# Altium project Video_Processing_Board.PrjPcb (part 2 of 2)

## Sheet Input Transceivers.SchDoc
size A2; SheetNumber: 5; SheetTotal: 8; SPICEModelCacheFVAKUUFU: <root> / <DocumentId>FVAKUUFU</DocumentId> / </root>
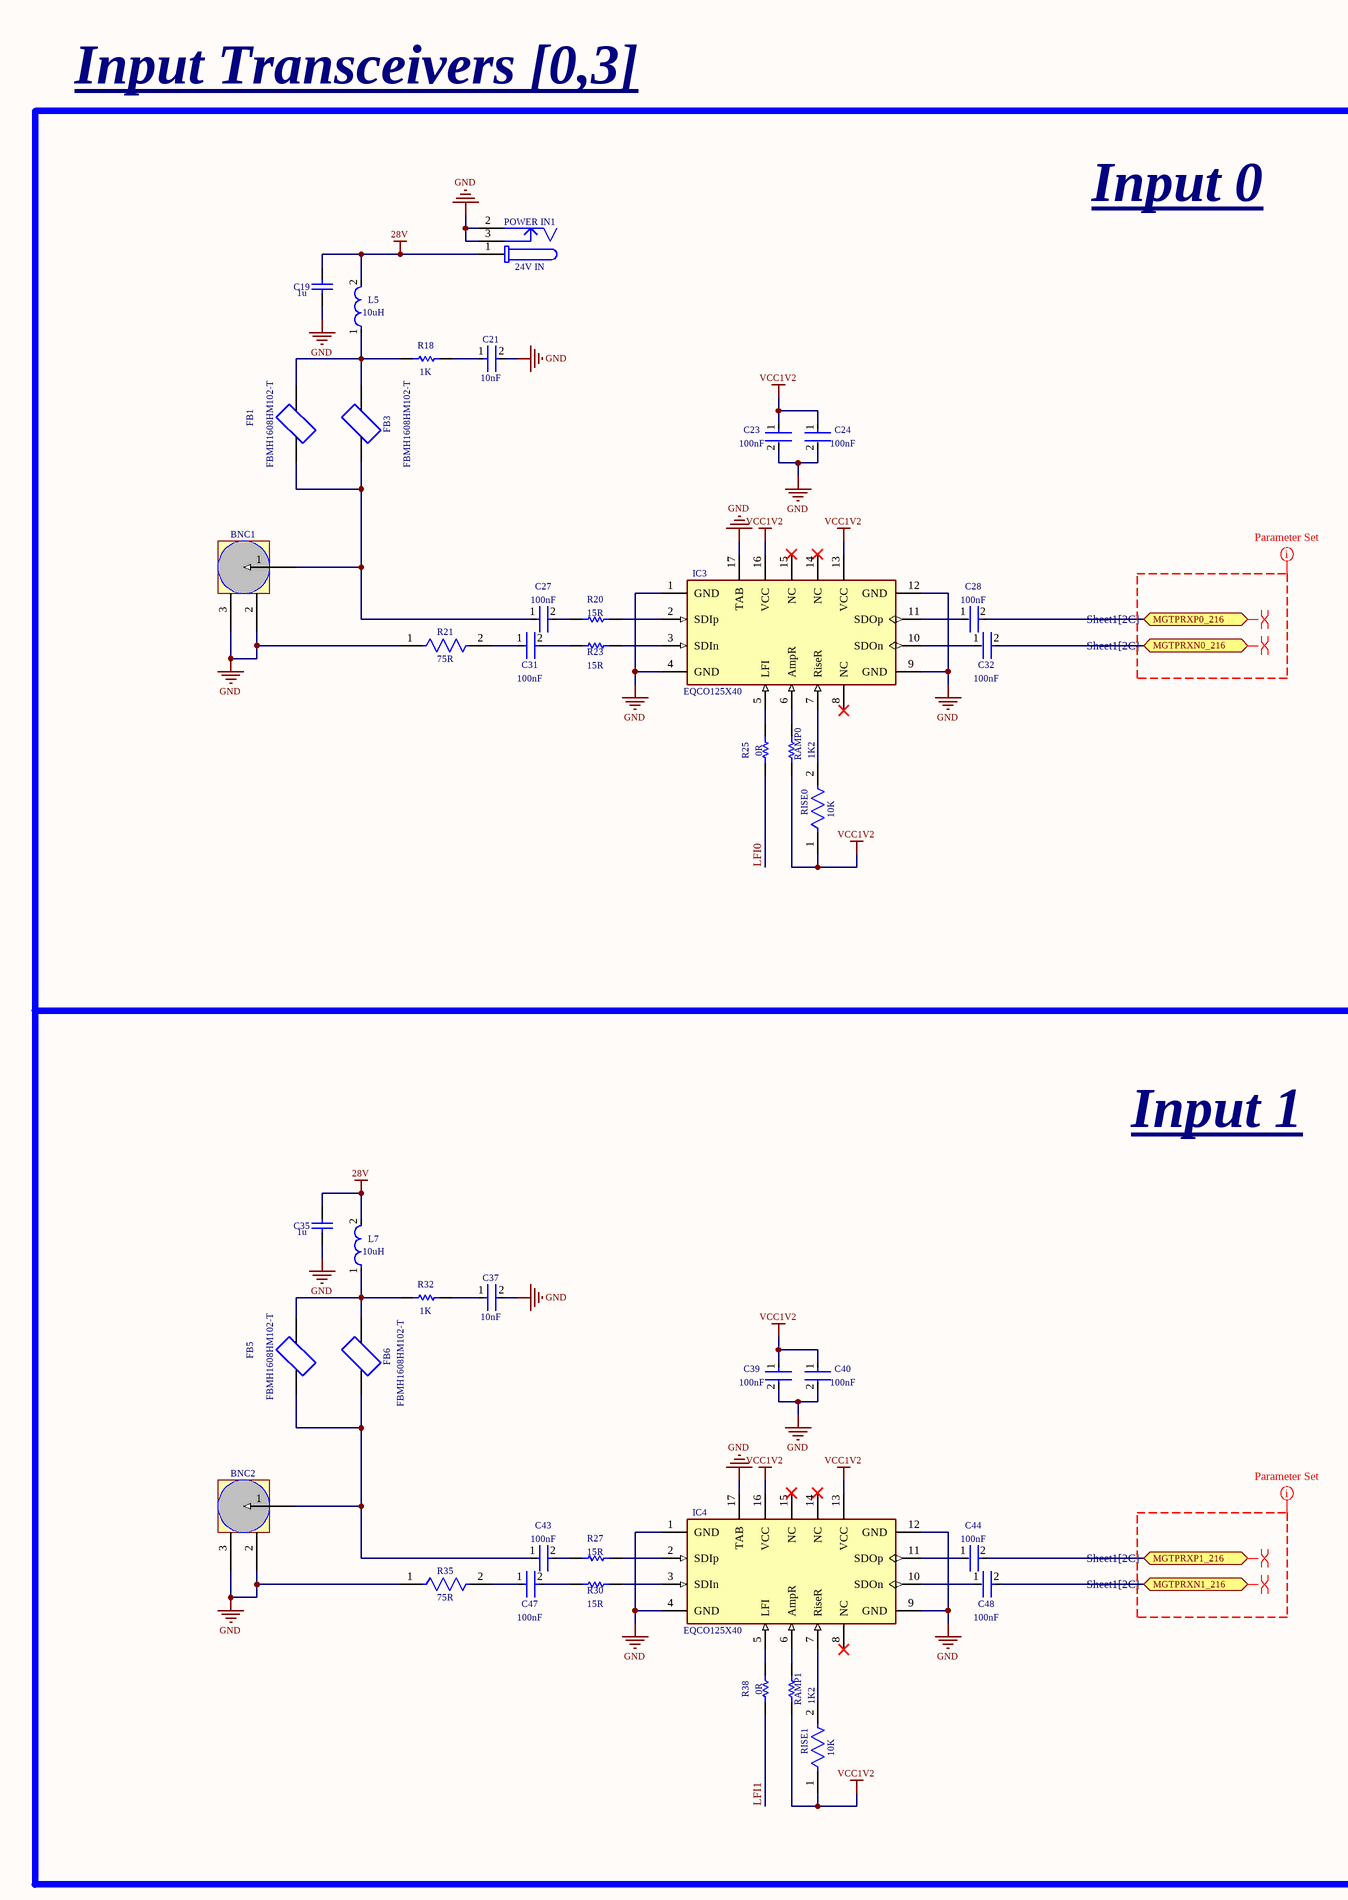
[diagram p4: Input Transceivers.SchDoc, left]
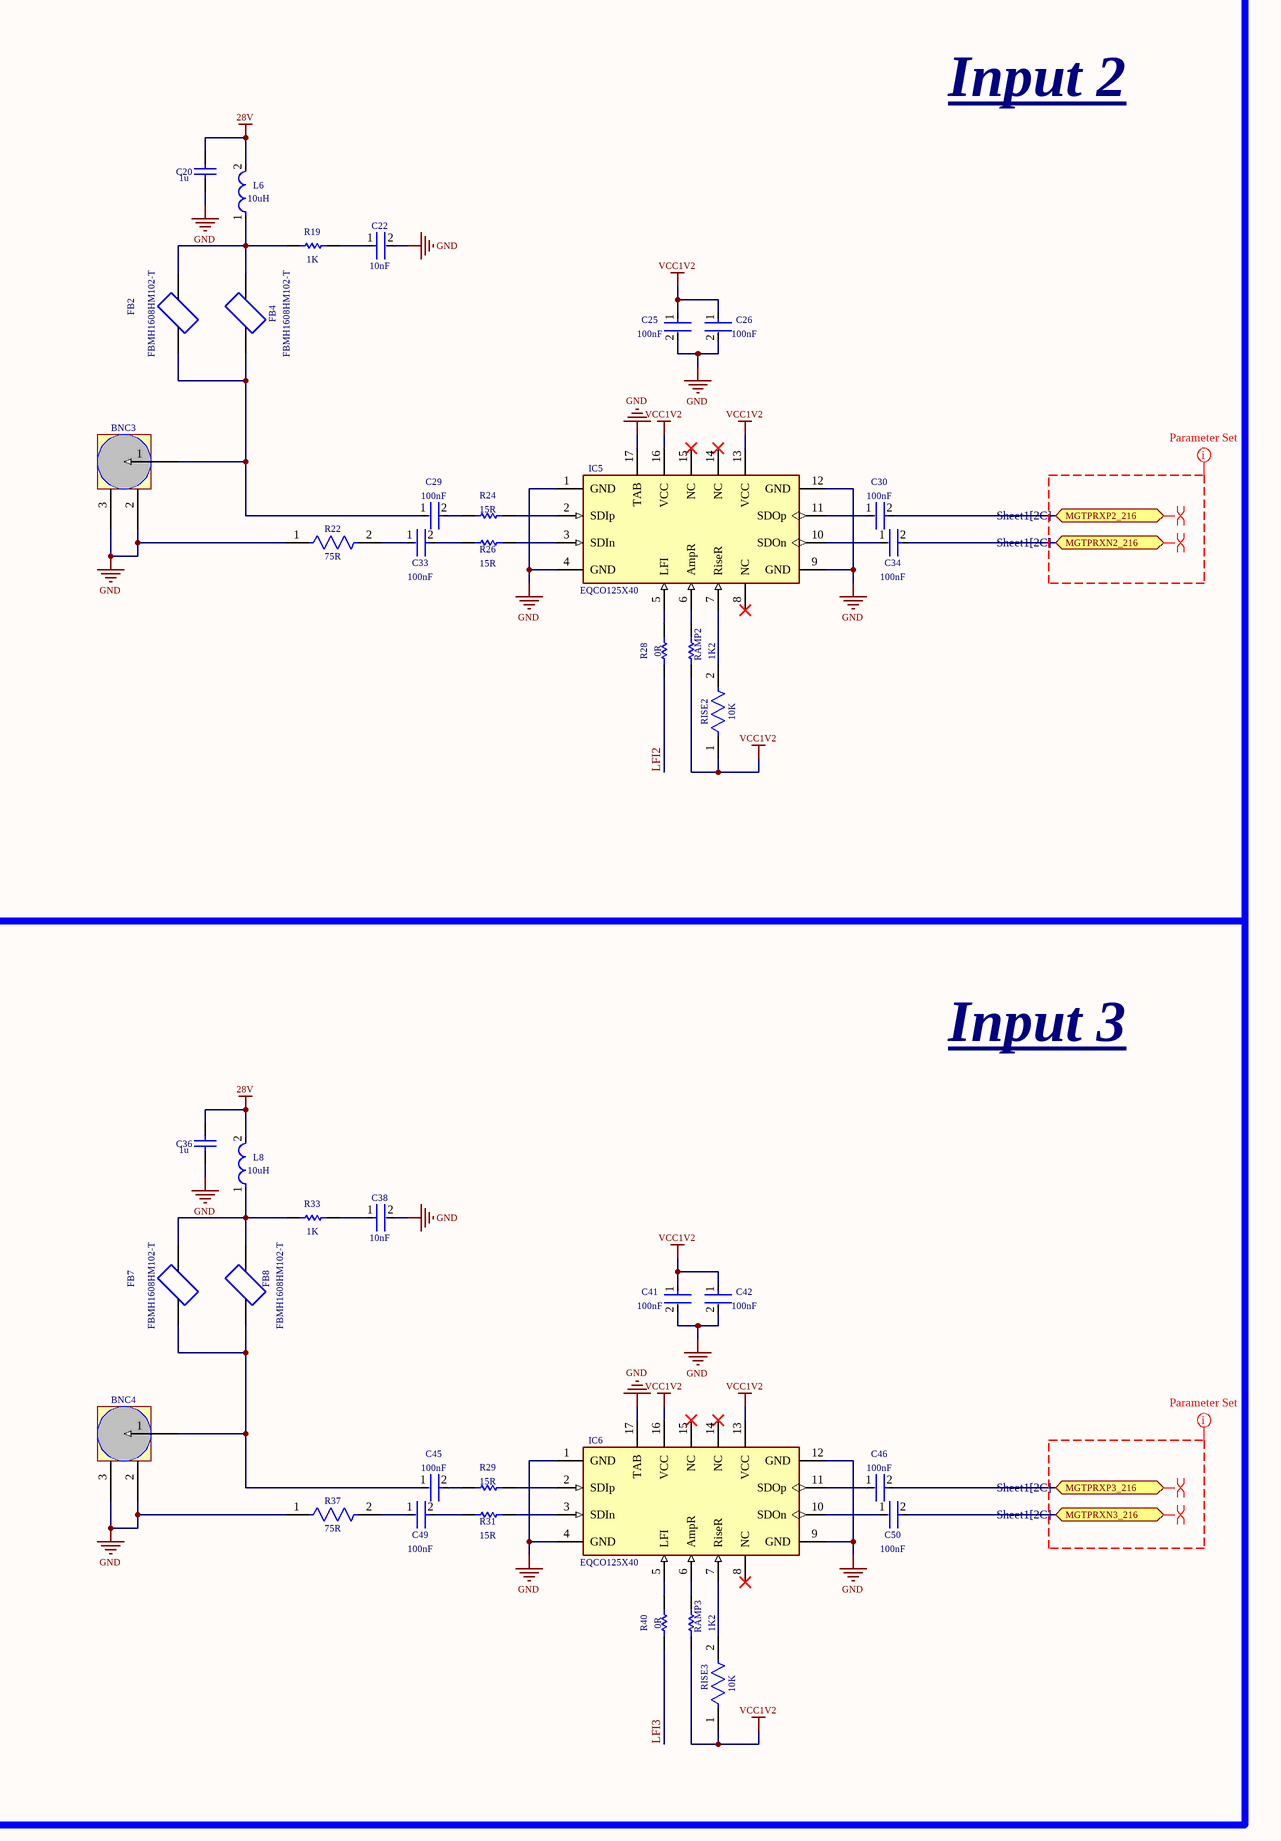
[diagram p5: Input Transceivers.SchDoc, right]

### Parts
BNC1  Amphenol_BNC_HD_034_1018  [PCBComponent_1 - duplicate]  (value not drawn)
BNC2  Amphenol_BNC_HD_034_1018  [PCBComponent_1 - duplicate]  (value not drawn)
BNC3  Amphenol_BNC_HD_034_1018  [PCBComponent_1 - duplicate]  (value not drawn)
BNC4  Amphenol_BNC_HD_034_1018  [PCBComponent_1 - duplicate]  (value not drawn)
C19  1u  [CAPC2013X135X45LL10T25]
C20  1u  [CAPC2013X135X45LL10T25]
C21  10nF  [FP-CL165-IPC_C]
C22  10nF  [FP-CL165-IPC_C]
C23  100nF  [FP-C0402-BB-MFG]
C24  100nF  [FP-C0402-BB-MFG]
C25  100nF  [FP-C0402-BB-MFG]
C26  100nF  [FP-C0402-BB-MFG]
C27  100nF  [FP-GRM15-MFG]
C28  100nF  [FP-GRM15-MFG]
C29  100nF  [FP-GRM15-MFG]
C30  100nF  [FP-GRM15-MFG]
C31  100nF  [FP-GRM15-MFG]
C32  100nF  [FP-GRM15-MFG]
C33  100nF  [FP-GRM15-MFG]
C34  100nF  [FP-GRM15-MFG]
C35  1u  [CAPC2013X135X45LL10T25]
C36  1u  [CAPC2013X135X45LL10T25]
C37  10nF  [FP-CL165-IPC_C]
C38  10nF  [FP-CL165-IPC_C]
C39  100nF  [FP-C0402-BB-MFG]
C40  100nF  [FP-C0402-BB-MFG]
C41  100nF  [FP-C0402-BB-MFG]
C42  100nF  [FP-C0402-BB-MFG]
C43  100nF  [FP-GRM15-MFG]
C44  100nF  [FP-GRM15-MFG]
C45  100nF  [FP-GRM15-MFG]
C46  100nF  [FP-GRM15-MFG]
C47  100nF  [FP-GRM15-MFG]
C48  100nF  [FP-GRM15-MFG]
C49  100nF  [FP-GRM15-MFG]
C50  100nF  [FP-GRM15-MFG]
FB1  FBMH1608HM102-T  [FBMH1608HM102-T]
FB2  FBMH1608HM102-T  [FBMH1608HM102-T]
FB3  FBMH1608HM102-T  [FBMH1608HM102-T]
FB4  FBMH1608HM102-T  [FBMH1608HM102-T]
FB5  FBMH1608HM102-T  [FBMH1608HM102-T]
FB6  FBMH1608HM102-T  [FBMH1608HM102-T]
FB7  FBMH1608HM102-T  [FBMH1608HM102-T]
FB8  FBMH1608HM102-T  [FBMH1608HM102-T]
IC3  EQCO125X40  [EQCO125X40]
IC4  EQCO125X40  [EQCO125X40]
IC5  EQCO125X40  [EQCO125X40]
IC6  EQCO125X40  [EQCO125X40]
L5  10uH  [FP-1812PS-MFG]
L6  10uH  [FP-1812PS-MFG]
L7  10uH  [FP-1812PS-MFG]
L8  10uH  [FP-1812PS-MFG]
POWER_IN1  24V IN  [694102107102]
R18  1K  [RESC1608X55X30LL15T15]
R19  1K  [RESC1608X55X30LL15T15]
R20  15R  [RESC1005X40X25ML10T10]
R21  75R  [FP-ERJ2RK-IPC_B]
R22  75R  [FP-ERJ2RK-IPC_B]
R23  15R  [RESC1005X40X25ML10T10]
R24  15R  [RESC1005X40X25ML10T10]
R25  0R  [RESC1005X40X25NL05T10]
R26  15R  [RESC1005X40X25ML10T10]
R27  15R  [RESC1005X40X25ML10T10]
R28  0R  [RESC1005X40X25NL05T10]
R29  15R  [RESC1005X40X25ML10T10]
R30  15R  [RESC1005X40X25ML10T10]
R31  15R  [RESC1005X40X25ML10T10]
R32  1K  [RESC1608X55X30LL15T15]
R33  1K  [RESC1608X55X30LL15T15]
R35  75R  [FP-ERJ2RK-IPC_B]
R37  75R  [FP-ERJ2RK-IPC_B]
R38  0R  [RESC1005X40X25NL05T10]
R40  0R  [RESC1005X40X25NL05T10]
RAMP0  1K2  [RESC1608X55X25LL10T15]
RAMP1  1K2  [RESC1608X55X25LL10T15]
RAMP2  1K2  [RESC1608X55X25LL10T15]
RAMP3  1K2  [RESC1608X55X25LL10T15]
RISE0  10K  [FP-RC0603-0_55-IPC_C]
RISE1  10K  [FP-RC0603-0_55-IPC_C]
RISE2  10K  [FP-RC0603-0_55-IPC_C]
RISE3  10K  [FP-RC0603-0_55-IPC_C]

### Ports
MGTPRXN0_216 (bidir, see Sheet1[2C]), MGTPRXN1_216 (bidir, see Sheet1[2C]), MGTPRXN2_216 (bidir, see Sheet1[2C]), MGTPRXN3_216 (bidir, see Sheet1[2C]), MGTPRXP0_216 (bidir, see Sheet1[2C]), MGTPRXP1_216 (bidir, see Sheet1[2C]), MGTPRXP2_216 (bidir, see Sheet1[2C]), MGTPRXP3_216 (bidir, see Sheet1[2C])

### Nets
28V: C19.2 C20.2 C35.2 C36.2 L5.2 L6.2 L7.2 L8.2 POWER_IN1.1
GND: BNC1.2 BNC1.3 BNC2.2 BNC2.3 BNC3.2 BNC3.3 BNC4.2 BNC4.3 C19.1 C20.1 C21.2 C22.2 C23.2 C24.2 C25.2 C26.2 C35.1 C36.1 C37.2 C38.2 C39.2 C40.2 C41.2 C42.2 IC3.1(GND) IC3.4(GND) IC3.9(GND) IC3.12(GND) IC3.17(TAB) IC4.1(GND) IC4.4(GND) IC4.9(GND) IC4.12(GND) IC4.17(TAB) IC5.1(GND) IC5.4(GND) IC5.9(GND) IC5.12(GND) IC5.17(TAB) IC6.1(GND) IC6.4(GND) IC6.9(GND) IC6.12(GND) IC6.17(TAB) POWER_IN1.2 POWER_IN1.3 R21.1 R22.1 R35.1 R37.1
VCC1V2: C23.1 C24.1 C25.1 C26.1 C39.1 C40.1 C41.1 C42.1 IC3.13(VCC) IC3.16(VCC) IC4.13(VCC) IC4.16(VCC) IC5.13(VCC) IC5.16(VCC) IC6.13(VCC) IC6.16(VCC) RAMP0.1 RAMP1.1 RAMP2.1 RAMP3.1 RISE0.1 RISE1.1 RISE2.1 RISE3.1
LFI0: R25.1
LFI1: R38.1
LFI2: R28.1
LFI3: R40.1
NetBNC1_1: BNC1.1 C27.1 FB1.1 FB3.1
NetBNC2_1: BNC2.1 C43.1 FB5.1 FB6.1
NetBNC3_1: BNC3.1 C29.1 FB2.1 FB4.1
NetBNC4_1: BNC4.1 C45.1 FB7.1 FB8.1
NetC21_1: C21.1 R18.2
NetC22_1: C22.1 R19.2
NetC27_2: C27.2 R20.1
NetC28_1: C28.1 IC3.11(SDOp)
NetC28_2: C28.2 ; port MGTPRXP0_216
NetC29_2: C29.2 R24.1
NetC30_1: C30.1 IC5.11(SDOp)
NetC30_2: C30.2 ; port MGTPRXP2_216
NetC31_1: C31.1 R21.2
NetC31_2: C31.2 R23.1
NetC32_1: C32.1 IC3.10(SDOn)
NetC32_2: C32.2 ; port MGTPRXN0_216
NetC33_1: C33.1 R22.2
NetC33_2: C33.2 R26.1
NetC34_1: C34.1 IC5.10(SDOn)
NetC34_2: C34.2 ; port MGTPRXN2_216
NetC37_1: C37.1 R32.2
NetC38_1: C38.1 R33.2
NetC43_2: C43.2 R27.1
NetC44_1: C44.1 IC4.11(SDOp)
NetC44_2: C44.2 ; port MGTPRXP1_216
NetC45_2: C45.2 R29.1
NetC46_1: C46.1 IC6.11(SDOp)
NetC46_2: C46.2 ; port MGTPRXP3_216
NetC47_1: C47.1 R35.2
NetC47_2: C47.2 R30.1
NetC48_1: C48.1 IC4.10(SDOn)
NetC48_2: C48.2 ; port MGTPRXN1_216
NetC49_1: C49.1 R37.2
NetC49_2: C49.2 R31.1
NetC50_1: C50.1 IC6.10(SDOn)
NetC50_2: C50.2 ; port MGTPRXN3_216
NetFB1_2: FB1.2 FB3.2 L5.1 R18.1
NetFB2_2: FB2.2 FB4.2 L6.1 R19.1
NetFB5_2: FB5.2 FB6.2 L7.1 R32.1
NetFB7_2: FB7.2 FB8.2 L8.1 R33.1
NetIC3_2: IC3.2(SDIp) R20.2
NetIC3_3: IC3.3(SDIn) R23.2
NetIC3_5: IC3.5(LFI) R25.2
NetIC3_6: IC3.6(AmpR) RAMP0.2
NetIC3_7: IC3.7(RiseR) RISE0.2
NetIC4_2: IC4.2(SDIp) R27.2
NetIC4_3: IC4.3(SDIn) R30.2
NetIC4_5: IC4.5(LFI) R38.2
NetIC4_6: IC4.6(AmpR) RAMP1.2
NetIC4_7: IC4.7(RiseR) RISE1.2
NetIC5_2: IC5.2(SDIp) R24.2
NetIC5_3: IC5.3(SDIn) R26.2
NetIC5_5: IC5.5(LFI) R28.2
NetIC5_6: IC5.6(AmpR) RAMP2.2
NetIC5_7: IC5.7(RiseR) RISE2.2
NetIC6_2: IC6.2(SDIp) R29.2
NetIC6_3: IC6.3(SDIn) R31.2
NetIC6_5: IC6.5(LFI) R40.2
NetIC6_6: IC6.6(AmpR) RAMP3.2
NetIC6_7: IC6.7(RiseR) RISE3.2

Not connected (* = marked no-connect by the designer): IC3 8(NC)* 14(NC)* 15(NC)*; IC4 8(NC)* 14(NC)* 15(NC)*; IC5 8(NC)* 14(NC)* 15(NC)*; IC6 8(NC)* 14(NC)* 15(NC)*

### Layout directives
differential pair: NetC28_2, NetC30_2, NetC32_2, NetC34_2, NetC44_2, NetC46_2, NetC48_2, NetC50_2

### Notes on the sheet
- Input Transceivers [0,3]
- Input 0
- Input 2
- Input 1
- Input 3

### Library data of the parts
BNC1-BNC4 = Component_1_3
C19 C20 C35 C36 = CMP-1036-04761-2: Manufacturer: Murata; Part Number: GRM21BR71H105KA12L
C21 C22 C37 C38 = CMP-13271-000387-1: Cap Ceramic 10nF 50V X7R ±10% SMD 0402 +125°C Paper T/R; Depth: 0.5mm; Length: 1mm; Lead Free: Lead Free; Case Code (Metric): 1005; Width: 0.02inch; Min Operating Temperature: -55°C; Thickness: 0.022inch; Package Quantity: 1; Mount: Surface Mount; Height: 0.5mm; Voltage: 50V; Material: Ceramic; Tolerance: 10%; Case Code (Imperial): 0402; Radiation Hardening: No; Case/Package: 0402; Max Operating Temperature: 125°C; Voltage Rating (DC): 50V; Contact Plating: Tin; Packaging: Tape and Reel; Voltage Rating: 50V; Capacitance: 10nF; Dielectric: X7R
C23-C26 C39-C42 = CMP-2008-02108-2: CAP CER 0.1UF 16V X7R 0402; Manufacturer: Kemet; Manufacturer Part Number: C0402C104K4RACTU; Value: 0.10 μF; Tolerance: 0.1; Material: Ceramic; Temperature Coefficient: 15%; Voltage Rating: 16 V; Package: C0402-BB; Automotive: No; Ipc Land Pattern Name: CAPC10050X50; Device Class L3: Ceramic Capacitors; Capacitance: 0.10 μF; Octopart: https://octopart.com/c0402c104k4ractu-kemet-94158; Temperature Characteristic: X7R; Mouser Description: Cap Ceramic 0.1uF 16V X7R 10% SMD 0402 125?C Paper T/R - Tape and Reel (Alt: C0402C104K4RAC TU); ComponentLink2Description: Datasheet; Temperature Range Low: -55°C; RoHS: TRUE; Device Class L1: Passive Components; Temperature Range High: +125°C; Device Class L2: Capacitors; ComponentLink2URL: https://content.kemet.com/datasheets/KEM_C1002_X7R_SMD.pdf; Category: Cap; Height: 0.55mm; Temperature: -55°C to +125°C; Lead Free: Yes; Digikey Description: CAP CER 0.1UF 16V X7R 0402
C27-C34 C43-C50 = CMP-2100-03641-2: CAP CER 0.1UF 16V X7R 0402; Manufacturer Part Number: GRM155R71C104KA88D; Manufacturer: Murata; Standoff Height: 0mm; Tolerance: 10%; Voltage Rating: 16Vdc; Material: Ceramic; Capacitance: 0.10μF; Value: 0.10μF; RoHS: TRUE; Temperature Characteristic: X7R; Octopart: https://octopart.com/grm155r71c104ka88d-murata-196880; Digikey Description: CAP CER 0.1UF 16V X7R 0402; Device Class L3: Ceramic Capacitors; Height: 0.55mm; ComponentLink2Description: Datasheet; Temperature Range Low: -55°C; Ipc Land Pattern Name: CAPC10050X219; ComponentLink2URL: https://search.murata.co.jp/Ceramy/image/img/A01X/G101/ENG/GRM155R71H471KA01-01A.pdf; Device Class L1: Passive Components; Lead Free: yes; Category: Cap; Package: GRM15; Temperature: -55°C to +125°C; Device Class L2: Capacitors; Temperature Range High: +125°C; Mouser Description: 0402 0.1 uF 16V ±10 % Tolerance X7R SMT Multilayer Ceramic Capacitor
FB1-FB8 = FBMH1608HM102-T: Jumper; Part_Number: J00001; ID: 110; Mounting_Type: SMT; Part_Name: Jumper; ComponentLink1Description: Datasheet
IC3-IC6 = EQCO125X40: 12.5 Gbps Asymmetric Equalizer/Driver/Repeater; Part_Number: J00001; Part_Name: Jumper; ID: 110; Mounting_Type: SMT; ComponentLink1Description: Datasheet
L5-L8 = CMP-11268-000188-1: Fixed Inductors 1812PS Hi SRF Shlded 10uH 5 % 1.7 A; Core Material: Ferrite; Test Frequency: 100kHz; DC Resistance (DCR): 170mR; Self Resonant Frequency: 120MHz; Q Factor: 40; Shielding: Shielded; Tolerance: 5%; Max DC Current: 1.7A; Inductance: 10uH; Height: 3.81mm; Length: 5.87mm; Case/Package: 1812; Series: 1812PS; Packaging: Tape and Reel; Package Quantity: 600; Width: 4.98mm; Max Operating Temperature: 105°C; Termination: SMD/SMT; Lead Free: Contains Lead; Min Operating Temperature: -40°C; RoHS Compliant: Yes
POWER_IN1 = CMP-1502-00174-2: NexarPartId: 52645180; Connector Type: Power; Insulation Resistance: 100MΩ; Gender: Male; Current Rating: 5A; Voltage Rating: 18V; Shielding: Unshielded; Mount: Surface Mount; Packaging: Tape and Reel; Max Operating Temperature: 85°C; Color: Black; Contact Plating: Tin; Min Operating Temperature: -40°C; Housing Material: Polyamide; Termination: SMD/SMT; RoHS: Compliant; Contact Gender: Female; REACH SVHC: Unknown; Voltage Rating (DC): 18V; Operating Supply Voltage: 18V; Flammability Rating: UL94 V-0
R18 R19 R32 R33 = CMP-2000-00180-1: Part Number: ERJ-3EKF1001V; Manufacturer: Panasonic
R20 R23 R24 R26 R27 R29-R31 = CMP-2002-05954-1: Manufacturer: Multicomp; Part Number: MC00625W0402115R
R21 R22 R35 R37 = CMP-2002-01061-2: RES SMD 75 OHM 1% 1/10W 0402; Max Power Dissipation: 100mW; Voltage Rating: 50V; Temperature Coefficient: 100ppm/°C; Radiation Hardening: No; Resistor Type: Thick Film; Contact Plating: Tin; Military Standard: Not; Package Quantity: 1; Packaging: Tape and Reel; Resistance Tolerance: 1%; RoHS Compliant: Yes; Depth: 0.5mm; Construction: Rectangular; Series: ERJ; Resistance: 75R; Lead Free: Lead Free; REACH SVHC: No SVHC; Power Rating: 100mW; Length: 1mm; Termination: SMD/SMT; Case Code (Metric): 1005; Features: Automotive AEC-Q200; Case/Package: 0402; Technology: THICK FILM; Case Code (Imperial): 0402; Tolerance: 1%; Max Operating Temperature: 155°C; Size Code: 0402; Min Operating Temperature: -55°C; Number of Terminations: 2; Voltage Rating (DC): 50V; Height: 0.35mm; Mount: Surface Mount; Width: 0.02inch
R25 R28 R38 R40 = CMP-1011-00001-2: Manufacturer: Yageo / Phycomp; Part Number: RC0402JR-070RL
RAMP0-RAMP3 = CMP-1659-00042-1: Chip Resistor, 1.2 KOhm, +/- 1%, 0.1 W, -55 to 155 degC, 0603 (1608 Metric), RoHS, Tape and Reel; Resistance: 825 kohm; Voltage Rating: 50 V; Power Rating: 100 mW; Case\Package: 0603; DatasheetVersion: Rev. 4, 02/2016; Package Quantity: 5000; Min Operating Temperature: -55 degC; PackageReference: 0603; ComponentLink1Description: Manufacturer URL; Tolerance: 1%; ComponentLink2Description: Datasheet; Packaging: Tape and Reel; PackageDescription: 2-Pin Surface Mount Device, Body 1.6 x 0.8 mm; Width: 0.8 mm; ComponentLink2URL: http://www.yageo.com/documents/recent/PYu-RC_Group_51_RoHS_L_04.pdf; ComponentLink1URL: http://www.yageo.com/; Max Operating Temperature: 155 degC; RoHSCompliant: true; Height: 0.45 mm; Case Code (Imperial): 0603; Case Code (Metric): 1608; Length: 1.6 mm
RISE0-RISE3 = CMP-2100-03664-2: RES 10K OHM 1% 1/10W 0603; Voltage Rating: 75V; Voltage Rating (DC): 50V; Resistance: 10kR; Power Rating: 100mW; Temperature Coefficient: 100ppm/°C; Depth: 0.8mm; Termination: SMD/SMT; Resistor Type: Thick Film; Series: RC; Construction: Rectangular; Features: Moisture Resistant; Packaging: Tape and Reel; Min Operating Temperature: -55°C; Number of Terminations: 2; Lead Pitch: 0.3mm; RoHS Compliant: Yes; Case/Package: 0603; Resistance Tolerance: 1%; Military Standard: Not; Weight: 7.1E-05oz; Number of Pins: 2; Tolerance: 1%; Length: 1.6mm; Case Code (Imperial): 0603; Lead Free: Lead Free; Width: 0.8mm; Max Power Dissipation: 100mW; Height: 0.45mm; Max Operating Temperature: 155°C; Case Code (Metric): 1608; Size Code: 0603

## Sheet Output Transceivers.SchDoc
size A2; SheetNumber: 6; SheetTotal: 8
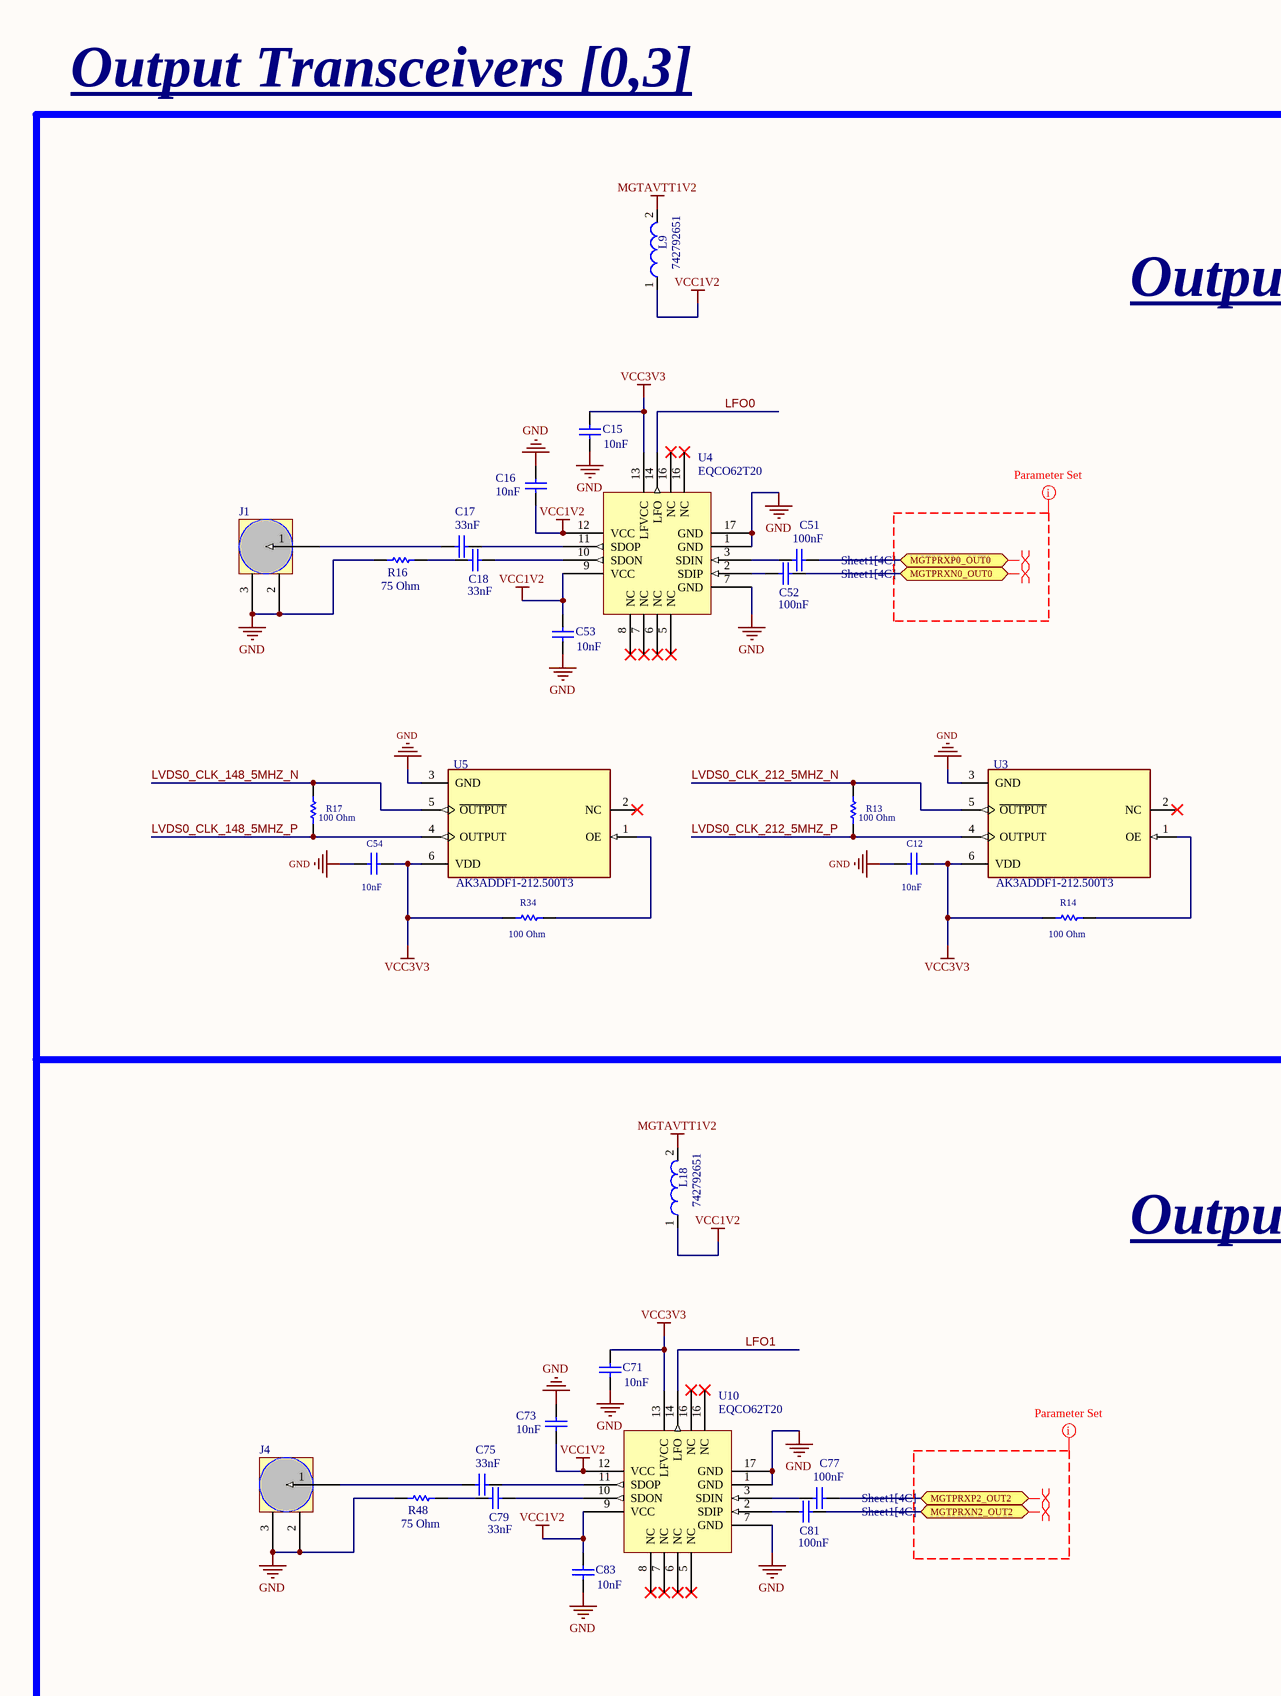
[diagram p6: Output Transceivers.SchDoc, left]
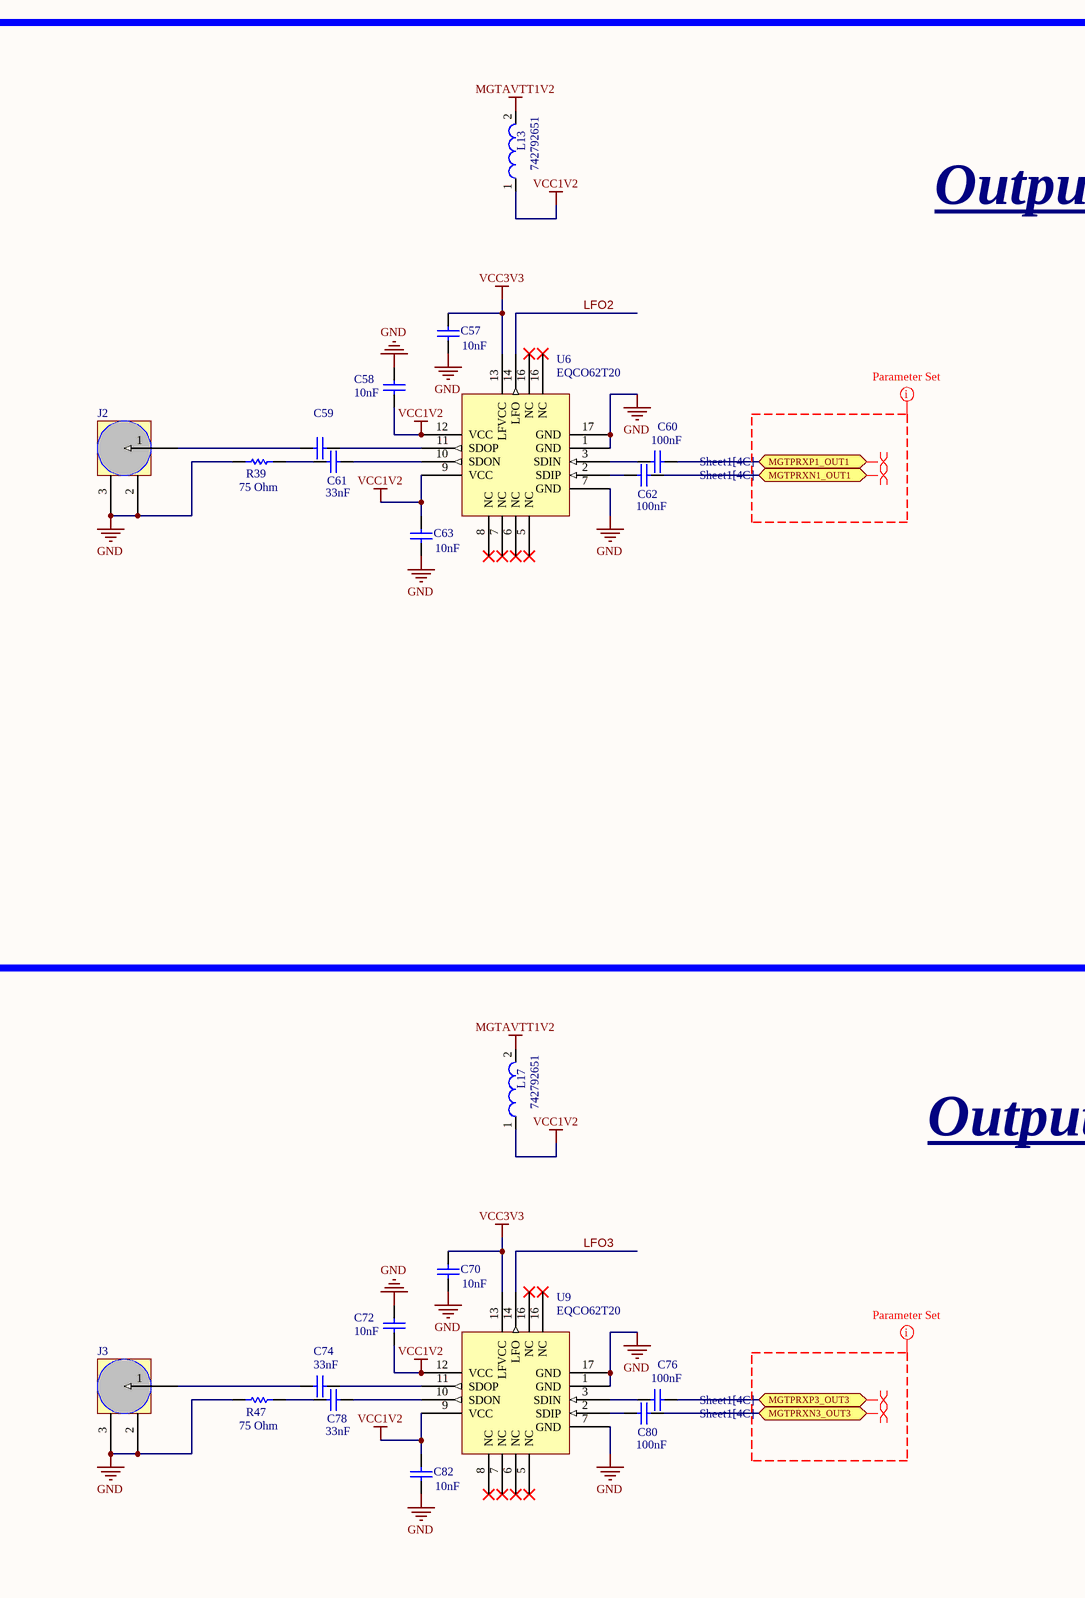
[diagram p7: Output Transceivers.SchDoc, right]

### Parts
C12  10nF  [0402]
C15  10nF  [0402]
C16  10nF  [0402]
C17  33nF  [0603]
C18  33nF  [0603]
C51  100nF  [0402]
C52  100nF  [0402]
C53  10nF  [0402]
C54  10nF  [0402]
C57  10nF  [0402]
C58  10nF  [0402]
C59  33nF  [0603]  (value not drawn)
C60  100nF  [0402]
C61  33nF  [0603]
C62  100nF  [0402]
C63  10nF  [0402]
C70  10nF  [0402]
C71  10nF  [0402]
C72  10nF  [0402]
C73  10nF  [0402]
C74  33nF  [0603]
C75  33nF  [0603]
C76  100nF  [0402]
C77  100nF  [0402]
C78  33nF  [0603]
C79  33nF  [0603]
C80  100nF  [0402]
C81  100nF  [0402]
C82  10nF  [0402]
C83  10nF  [0402]
J1  (no value)  [PCBComponent_1 - duplicate]
J2  (no value)  [PCBComponent_1 - duplicate]
J3  (no value)  [PCBComponent_1 - duplicate]
J4  (no value)  [PCBComponent_1 - duplicate]
L9  742792651  [SMD-0603]
L13  742792651  [SMD-0603]
L17  742792651  [SMD-0603]
L18  742792651  [SMD-0603]
R13  100 Ohm  [3-0603]
R14  100 Ohm  [3-0603]
R16  75 Ohm  [3-0603]
R17  100 Ohm  [3-0603]
R34  100 Ohm  [3-0603]
R39  75 Ohm  [3-0603]
R47  75 Ohm  [3-0603]
R48  75 Ohm  [3-0603]
U3  AK3ADDF1-212.500T3  [AX3DAF1-148.5000T]
U4  EQCO62T20  [PCBComponent_1_2]
U5  AK3ADDF1-212.500T3  [AX3DAF1-148.5000T]
U6  EQCO62T20  [PCBComponent_1_2]
U9  EQCO62T20  [PCBComponent_1_2]
U10  EQCO62T20  [PCBComponent_1_2]

### Ports
MGTPRXN0_OUT0 (bidir, see Sheet1[4C]), MGTPRXN1_OUT1 (bidir, see Sheet1[4C]), MGTPRXN2_OUT2 (bidir, see Sheet1[4C]), MGTPRXN3_OUT3 (bidir, see Sheet1[4C]), MGTPRXP0_OUT0 (bidir, see Sheet1[4C]), MGTPRXP1_OUT1 (bidir, see Sheet1[4C]), MGTPRXP2_OUT2 (bidir, see Sheet1[4C]), MGTPRXP3_OUT3 (bidir, see Sheet1[4C])

### Nets
GND: C12.1 C15.1 C16.2 C53.1 C54.1 C57.1 C58.2 C63.1 C70.1 C71.1 C72.2 C73.2 C82.1 C83.1 J1.2 J1.3 J2.2 J2.3 J3.2 J3.3 J4.2 J4.3 R16.1 R39.1 R47.1 R48.1 U3.3(GND) U4.1(GND) U4.7(GND) U4.17(GND) U5.3(GND) U6.1(GND) U6.7(GND) U6.17(GND) U9.1(GND) U9.7(GND) U9.17(GND) U10.1(GND) U10.7(GND) U10.17(GND)
MGTAVTT1V2: L9.2 L13.2 L17.2 L18.2
VCC1V2: C16.1 C53.2 C58.1 C63.2 C72.1 C73.1 C82.2 C83.2 L9.1 L13.1 L17.1 L18.1 U4.9(VCC) U4.12(VCC) U6.9(VCC) U6.12(VCC) U9.9(VCC) U9.12(VCC) U10.9(VCC) U10.12(VCC)
VCC3V3: C12.2 C15.2 C54.2 C57.2 C70.2 C71.2 R14.1 R34.1 U3.6(VDD) U4.13(LFVCC) U5.6(VDD) U6.13(LFVCC) U9.13(LFVCC) U10.13(LFVCC)
LFO0: U4.14(LFO)
LFO1: U10.14(LFO)
LFO2: U6.14(LFO)
LFO3: U9.14(LFO)
LVDS0_CLK_148_5MHZ_N: R17.2 U5.5(~{OUTPUT})
LVDS0_CLK_148_5MHZ_P: R17.1 U5.4(OUTPUT)
LVDS0_CLK_212_5MHZ_N: R13.2 U3.5(~{OUTPUT})
LVDS0_CLK_212_5MHZ_P: R13.1 U3.4(OUTPUT)
NetC17_1: C17.1 J1.1
NetC17_2: C17.2 U4.11(SDOP)
NetC18_1: C18.1 R16.2
NetC18_2: C18.2 U4.10(SDON)
NetC51_1: C51.1 U4.3(SDIN)
NetC51_2: C51.2 ; port MGTPRXP0_OUT0
NetC52_1: C52.1 U4.2(SDIP)
NetC52_2: C52.2 ; port MGTPRXN0_OUT0
NetC59_1: C59.1 J2.1
NetC59_2: C59.2 U6.11(SDOP)
NetC60_1: C60.1 U6.3(SDIN)
NetC60_2: C60.2 ; port MGTPRXP1_OUT1
NetC61_1: C61.1 R39.2
NetC61_2: C61.2 U6.10(SDON)
NetC62_1: C62.1 U6.2(SDIP)
NetC62_2: C62.2 ; port MGTPRXN1_OUT1
NetC74_1: C74.1 J3.1
NetC74_2: C74.2 U9.11(SDOP)
NetC75_1: C75.1 J4.1
NetC75_2: C75.2 U10.11(SDOP)
NetC76_1: C76.1 U9.3(SDIN)
NetC76_2: C76.2 ; port MGTPRXP3_OUT3
NetC77_1: C77.1 U10.3(SDIN)
NetC77_2: C77.2 ; port MGTPRXP2_OUT2
NetC78_1: C78.1 R47.2
NetC78_2: C78.2 U9.10(SDON)
NetC79_1: C79.1 R48.2
NetC79_2: C79.2 U10.10(SDON)
NetC80_1: C80.1 U9.2(SDIP)
NetC80_2: C80.2 ; port MGTPRXN3_OUT3
NetC81_1: C81.1 U10.2(SDIP)
NetC81_2: C81.2 ; port MGTPRXN2_OUT2
NetR14_2: R14.2 U3.1(OE)
NetR34_2: R34.2 U5.1(OE)

Not connected (* = marked no-connect by the designer): U3 2(NC)*; U4 5(NC)* 6(NC)* 8(NC)* 16(NC)*; U5 2(NC)*; U6 5(NC)* 6(NC)* 8(NC)* 16(NC)*; U9 5(NC)* 6(NC)* 8(NC)* 16(NC)*; U10 5(NC)* 6(NC)* 8(NC)* 16(NC)*

### Layout directives
differential pair: NetC51_2, NetC52_2, NetC60_2, NetC62_2, NetC76_2, NetC77_2, NetC80_2, NetC81_2

### Notes on the sheet
- Output Transceivers [0,3]
- Output 0
- Output 2
- Output 1
- Output 3

### Library data of the parts
C12 C15 C16 C53 C54 C57 C58 C63 C70-C73 C82 C83 = C0402: C0402C103K9RACTU 10nF 6.3V; Note: Footprint corresponds to dimensions for bulk cassette packaging. This case size has tightened tolerances.; Published: 17-Jul-2002; LatestRevisionDate: 19-Mar-2004; LatestRevisionNote: Silkscreen size reduced.; DatasheetDocument: Mar-2001; PackageDocument: Mar-2001; PackageReference: 0402; Publisher: Altium Limited; Code_JEITA: 0402; Code_IPC: 1005 [0402]; ComponentLink1Description: Manufacturer Link; ComponentLink1URL: http://www.kemet.com/; ComponentLink2Description: Datasheet; ComponentLink2URL: http://www.kemet.com/kemet/web/homepage/kechome.nsf/vapubfilesname/F3102TA.pdf/$file/F3102TA.pdf
C17 C18 C59 C61 C74 C75 C78 C79 = C0603: C0603C333K5RACTU 33nF 50V; Note: Footprint corresponds to dimensions for bulk cassette packaging. This case size has tightened tolerances.; Published: 17-Jul-2002; LatestRevisionDate: 19-Mar-2004; LatestRevisionNote: Silkscreen size reduced.; DatasheetDocument: Mar-2001; PackageDocument: Mar-2001; PackageReference: 0603; Publisher: Altium Limited; Code_JEITA: 0603; Code_IPC: 1608 [0603]; ComponentLink1Description: Manufacturer Link; ComponentLink1URL: http://www.kemet.com/; ComponentLink2Description: Datasheet; ComponentLink2URL: http://www.kemet.com/kemet/web/homepage/kechome.nsf/vapubfilesname/F3102TA.pdf/$file/F3102TA.pdf
  C17 C18 C61 C74 C75 C78 C79: Value: 33nF
C51 C52 C60 C62 C76 C77 C80 C81 = C0402: C0402C104K8RACTU 100nF 10V; Note: Footprint corresponds to dimensions for bulk cassette packaging. This case size has tightened tolerances.; Published: 17-Jul-2002; LatestRevisionDate: 19-Mar-2004; LatestRevisionNote: Silkscreen size reduced.; DatasheetDocument: Mar-2001; PackageDocument: Mar-2001; PackageReference: 0402; Publisher: Altium Limited; Code_JEITA: 0402; Code_IPC: 1005 [0402]; ComponentLink1Description: Manufacturer Link; ComponentLink1URL: http://www.kemet.com/; ComponentLink2Description: Datasheet; ComponentLink2URL: http://www.kemet.com/kemet/web/homepage/kechome.nsf/vapubfilesname/F3102TA.pdf/$file/F3102TA.pdf; Value: 100nF
J1-J4 = Component_1: Amphenol_BNC_HD_034_1018
L9 L13 L17 L18 = 742792651: SMD EMI Suppression Ferrite Bead WE-CBF, Z = 600 Ohm; Impedance: 600 Ohm; DatasheetVersion: Dec-2005; PackageVersion: 2009; PackageReference: SMD-0603; PackageDescription: Chip Inductor, 2-Leads, Body 1.6 x 0.8 mm; ComponentLink1Description: Manufacturer URL; ComponentLink1URL: http://www.we-online.com; ComponentLink2Description: Datasheet; ComponentLink2URL: http://www.we-online.de/katalog/media/pdf/742792651.pdf
R13 R14 R16 R17 R34 R39 R47 R48 = ERJ3EK: Precision Thick Film Chip Resistor, 10 Ohm to 1M Ohm Range, 1% and 0.5% Tolerance, 0603 Size, 0.063 W; Published: 17-Dec-2003; LatestRevisionDate: 19-Mar-2004; LatestRevisionNote: Silkscreen size reduced.; PackageDocument: Mar-2003; PackageReference: 3-0603; Publisher: Altium Limited; Code_IPC: 1608 [0603]; ComponentLink1Description: Manufacturer Link; ComponentLink1URL: http://www.panasonic.com/industrial/components/resistive_products.htm; ComponentLink2Description: Datasheet; ComponentLink2URL: http://www.panasonic.com/industrial/components/pdf/AOA0000CE2.pdf
U3 U5 = AX3DAF1-148.5000T: 148.5 MHz XO (Standard) LVDS Oscillator 3.3V Enable/Disable 6-SMD, No Lead; Part_Number: J00001; Part_Name: AX3DAF1-148.5000T3; ID: 110; Mounting_Type: SMT; ComponentLink1Description: Datasheet
U4 U6 U9 U10 = Component_1

## Sheet JTAG & Reset Connection.SchDoc
size A2; SheetNumber: 7; SheetTotal: 8
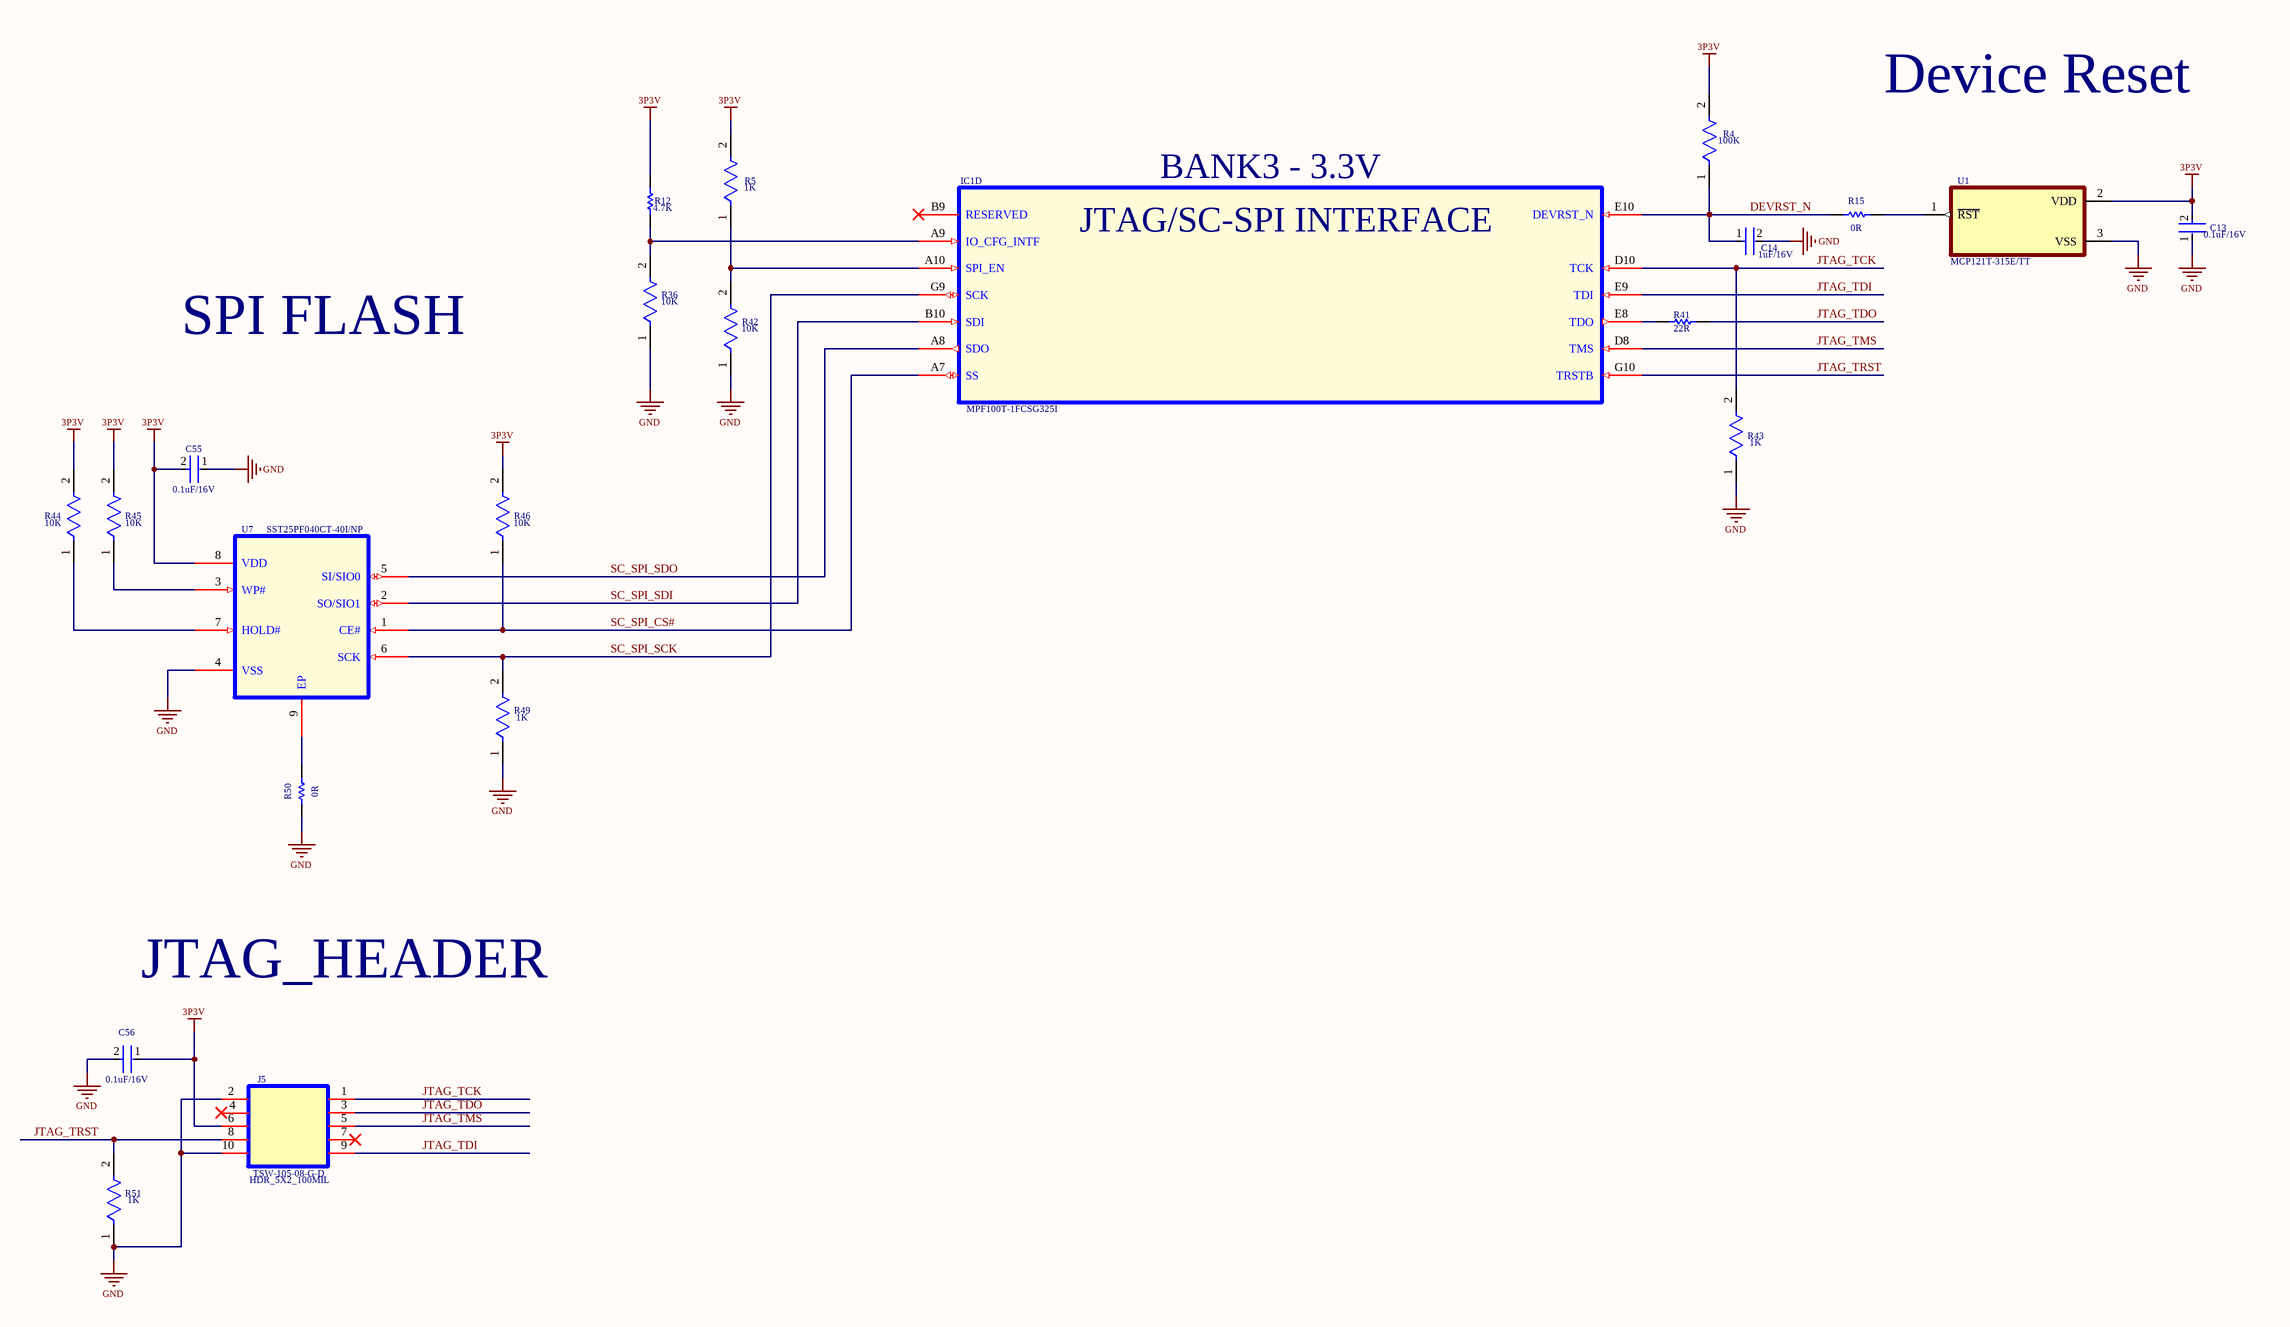
[diagram p8: JTAG & Reset Connection.SchDoc]

### Parts
C13  0.1uF/16V  [FP-GRM15-MFG]
C14  1uF/16V  [FP-0402-L_1_0_0_05-W_0_5-IPC_A]
C55  0.1uF/16V  [FP-GRM15-MFG]
C56  0.1uF/16V  [FP-GRM15-MFG]
IC1  MPF100T-1FCSG325I  [MPF100T-1FCSG325I]  (part D of 9)
J5  TSW-105-08-G-D  Parameter 1: HDR_5X2_100MIL  [TSW-105-08-G-D]
R4  100K  [FP-RC0603-0_55-MFG]
R5  1K  [FP-RC0603-0_55-IPC_C]
R12  4.7K  [RESC1608X55X25LL10T15]
R15  0R  [RESC1005X40X25NL05T10]
R36  10K  [FP-RC0603-0_55-IPC_C]
R41  22R  [RESC1005X40X25LL05T10]
R42  10K  [FP-RC0603-0_55-IPC_C]
R43  1K  [FP-RC0603-0_55-IPC_C]
R44  10K  [FP-RC0603-0_55-IPC_C]
R45  10K  [FP-RC0603-0_55-IPC_C]
R46  10K  [FP-RC0603-0_55-IPC_C]
R49  1K  [FP-RC0603-0_55-IPC_C]
R50  0R  [RESC1005X40X25NL05T10]
R51  1K  [FP-RC0603-0_55-IPC_C]
U1  MCP121T-315E/TT  [MCP121T-315E/TT]
U7  SST25PF040CT-40I/NP  [SST25PF040CT-40I/NP]

### Nets
3P3V: C13.2 C55.2 C56.1 J5.6 R4.2 R5.2 R12.2 R44.2 R45.2 R46.2 U1.2(VDD) U7.8(VDD)
GND: C13.1 C14.2 C55.1 C56.2 J5.2 J5.10 R36.1 R42.1 R43.1 R49.1 R50.1 R51.1 U1.3(VSS) U7.4(VSS)
DEVRST_N: C14.1 IC1.E10(DEVRST_N) R4.1 R15.1
JTAG_TCK: IC1.D10(TCK) J5.1 R43.2
JTAG_TDI: IC1.E9(TDI) J5.9
JTAG_TDO: J5.3 R41.1
JTAG_TMS: IC1.D8(TMS) J5.5
JTAG_TRST: IC1.G10(TRSTB) J5.8 R51.2
SC_SPI_CS#: IC1.A7(SS) R46.1 U7.1(CE#)
SC_SPI_SCK: IC1.G9(SCK) R49.2 U7.6(SCK)
SC_SPI_SDI: IC1.B10(SDI) U7.2(SO/SIO1)
SC_SPI_SDO: IC1.A8(SDO) U7.5(SI/SIO0)
NetIC1_A9: IC1.A9(IO_CFG_INTF) R12.1 R36.2
NetIC1_A10: IC1.A10(SPI_EN) R5.1 R42.2
NetIC1_E8: IC1.E8(TDO) R41.2
NetR15_2: R15.2 U1.1(~{RST})
NetR44_1: R44.1 U7.7(HOLD#)
NetR45_1: R45.1 U7.3(WP#)
NetR50_2: R50.2 U7.9(EP)

Not connected (* = marked no-connect by the designer): IC1 B9(RESERVED)*; J5 4(03) 7(08)*

### Notes on the sheet
- Device Reset
- SPI FLASH
- JTAG_HEADER
- (in symbol MPF100T-1FCSG325I, part D) BANK3 - 3.3V; JTAG/SC-SPI INTERFACE

### Library data of the parts
C13 C55 C56 = CMP-2100-03641-2: as C27 on sheet Input Transceivers; RoHS: TRUE; Temperature Characteristic: X7R; Octopart: https://octopart.com/grm155r71c104ka88d-murata-196880; Digikey Description: CAP CER 0.1UF 16V X7R 0402; Device Class L3: Ceramic Capacitors; Height: 0.55mm; ComponentLink2Description: Datasheet; Temperature Range Low: -55°C; Ipc Land Pattern Name: CAPC10050X219; ComponentLink2URL: https://search.murata.co.jp/Ceramy/image/img/A01X/G101/ENG/GRM155R71H471KA01-01A.pdf; Device Class L1: Passive Components; Lead Free: yes; Category: Cap; Package: GRM15; Temperature: -55°C to +125°C; Device Class L2: Capacitors; Temperature Range High: +125°C; Mouser Description: 0402 0.1 uF 16V ±10 % Tolerance X7R SMT Multilayer Ceramic Capacitor
C14 = CMP-14477-000104-2: None; Tolerance: 10%; Voltage Rating: 16V; Dielectric: X5R; Capacitance: 1uF; Packaging: Tape and Reel; Depth: 0.5mm; Mount: Surface Mount; Thickness: 0.022inch; Package Quantity: 1; Min Operating Temperature: -55°C; Series: M; Voltage Rating (DC): 16V; Termination: SMD/SMT; Case/Package: 0402; Number of Pins: 2; Case Code (Imperial): 0402; Length: 1mm; Halogen Free: Halogen Free; Case Code (Metric): 1005; Width: 0.02inch; RoHS Compliant: Yes; Radiation Hardening: No; Max Operating Temperature: 85°C; Height: 0.5mm; Construction: Flat
IC1 = MPF100T-1FCSG325I: as IC1 on sheet Connector; ComponentLink1Description: Datasheet
J5 = TSW-105-08-G-D: Jumper; Part_Number: J00001; ID: 110; Mounting_Type: SMT; Part_Name: Jumper; ComponentLink1Description: Datasheet
R4 = CMP-2100-03662-2: RES SMD 100K OHM 1% 1/10W 0603; Voltage Rating (DC): 50V; Resistance: 100kR; Max Power Dissipation: 100mW; Temperature Coefficient: 100ppm/°C; Working Voltage: 75V; Length: 1.6mm; Lead Free: Lead Free; Number of Terminations: 2; Packaging: Tape and Reel; Voltage Rating: 50V; Termination: SMD/SMT; Width: 0.8mm; Resistor Type: Thick Film; Resistance Tolerance: 1%; Features: Moisture Resistant; Height: 0.45mm; Construction: Rectangular; Case/Package: 0603; Military Standard: Not; Case Code (Imperial): 0603; Series: RC; Technology: THICK FILM; Depth: 0.8mm; RoHS Compliant: Yes; REACH SVHC: No SVHC; Min Operating Temperature: -55°C; Case Code (Metric): 1608; Max Operating Temperature: 155°C; Power Rating: 100mW; Number of Pins: 2; Tolerance: 1%
R5 R43 R49 R51 = CMP-1659-00009-5: RES 1K OHM 1% 1/10W 0603; Resistance: 1kR; Voltage Rating: 50V; Power Rating: 100mW; Temperature Coefficient: 100ppm/°C; Military Standard: Not; REACH SVHC: No SVHC; Size Code: 0603; Features: Moisture Resistant; Number of Terminations: 2; Technology: THICK FILM; Series: RC; Case Code (Metric): 1608; Resistance Tolerance: 1%; Resistor Type: Thick Film; Termination: SMD/SMT; Contact Plating: Tin; Radiation Hardening: No; Min Operating Temperature: -55°C; Max Operating Temperature: 155°C; Packaging: Tape and Reel; Max Power Dissipation: 100mW; RoHS Compliant: Yes; Height: 0.45mm; Lead Free: Lead Free; Case/Package: 0603; Length: 1.6mm; Tolerance: 1%; Case Code (Imperial): 0603; Construction: Rectangular; Depth: 0.8mm
R12 = CMP-2000-06942-1: Chip Resistor, 4.7 KOhm, +/- 1%, 0.1 W, -55 to 155 degC, 0603 (1608 Metric), RoHS, Tape and Reel; Manufacturer: Yageo; Power Rating: 100mW; Temperature Coefficient: 100PPM/C; Resistance: 4.7kOhms; Voltage Rating: 50V; Package Reference: 0603; Series: RC; Datasheet Version: Rev. 7, 05/2017; Packaging: Reel; Termination Style: SMD/SMT; Datasheet URL: http://www.yageo.com/documents/recent/PYu-RC_Group_51_RoHS_L_7.pdf; Manufacturer URL: http://www.yageo.com/; Package Description: 2-Pin Surface Mount Device, Body 1.6 x 0.8 mm; Case Code - mm: 1608; Case Code - in: 0603; Mounting Technology: SurfaceMount; Operating Temperature Range: -55Cto+155C; Tolerance: 1%; Product: ThickFilmResistorsGeneralPurpose
R15 R50 = CMP-1011-00001-2: as R25 on sheet Input Transceivers
R36 R42 R44-R46 = CMP-2100-03664-2: as RISE0 on sheet Input Transceivers; Depth: 0.8mm; Termination: SMD/SMT; Resistor Type: Thick Film; Series: RC; Construction: Rectangular; Features: Moisture Resistant; Packaging: Tape and Reel; Min Operating Temperature: -55°C; Number of Terminations: 2; Lead Pitch: 0.3mm; RoHS Compliant: Yes; Case/Package: 0603; Resistance Tolerance: 1%; Military Standard: Not; Weight: 7.1E-05oz; Number of Pins: 2; Tolerance: 1%; Length: 1.6mm; Case Code (Imperial): 0603; Lead Free: Lead Free; Width: 0.8mm; Max Power Dissipation: 100mW; Height: 0.45mm; Max Operating Temperature: 155°C; Case Code (Metric): 1608; Size Code: 0603
R41 = CMP-2002-07520-1: Manufacturer: Yageo / Phycomp; Part Number: RC0402FR-0722RL
U1 = MCP121T-315E/TT: Jumper; Part_Number: J00001; ID: 110; Mounting_Type: SMT; Part_Name: Jumper; ComponentLink1Description: Datasheet
U7 = SST25PF040CT-40I/NP: Jumper; Part_Number: J00001; ID: 110; Mounting_Type: SMT; Part_Name: Jumper; ComponentLink1Description: Datasheet

## Sheet USBModule.SchDoc
size A; SheetNumber: 8; SheetTotal: 9; SPICEModelCacheSHGCPFIO: <root> / <DocumentId>SHGCPFIO</DocumentId> / <CacheFrame Number="0"> / <Model Name="emk105bj105_v-f" Kind="CKT"> / <Text>* EMK105BJ105_V-F     SPICE MODEL  ( General Type ) / *-------------------------------------------------------------------------------------------------------- / * Model Generated by TAIYO YUDEN Corporation (http://www.ty-top.com) / * Version 1.0 / * TAIYO YUDEN Control No. 170508_130520 / * Copyright(c) 2012 TAIYO YUDEN CO.,LTD. All Rights Reserved. / *-------------------------------------------------------------------------------------------------------- / * / * Products Name : Multilayer Ceramic Capacitors / * / * Characteristics : / *     Capacitance : 1 uF , Rated Voltage : 16V , TCC : X5R / *     Case Size : 1.0 x 0.5 / 0.039 x 0.02 [mm/inch] , Thickness : 0.5 / 0.02 [mm/inch] / *     (Conditions: Temperature = 25 degC , DC Bias Current/Voltage = 0A / 0V) / * / * Frequency Range : 40Hz - 3GHz / * / * External Node Assignments : / * / *  1  o---| |---o  2 / * / *-------------------------------------------------------------------------------------------------------- / .SubCkt EMK105BJ105_V-F 1 2 / **************************** / C0 1 110 0.68309u / Cm 1 101 0.26053u / C1 101 102 0.94076u / Rc1 101 102 1.9029k / C2 102 103 0.66707u / Rc2 102 103 120.36 / C3 103 110 0.57203u / Rc3 103 110 2.1097 / C2m 1 301 0.1871u / C21 301 302 3.2494u / Rc21 301 302 1.1117k / C22 302 303 2.1014u / Rc22 302 303 1.484k / C23 303 304 2.1172u / Rc23 303 304 1.3876k / C24 304 305 0.75729u / Rc24 304 305 332.59 / C25 305 306 0.94401u / Rc25 305 306 249.09 / C26 306 307 0.34674u / Rc26 306 307 28.352 / C27 307 308 0.37158u / Rc27 307 308 19.989 / C28 308 309 0.17933u / Rc28 308 309 31.748 / C29 309 110 0.016445u / Rc29 309 110 1.0592 / Rp0 1 110 100Meg / L0 110 120 0.2216n / Lm 120 130 0.1509n / L1 120 121 0.12659n / RL1 121 130 0.85161 / L2 120 122 0.15996n / RL2 122 130 0.42469 / L3 120 123 7.9543n / RL3 123 130 0.54643m / CR 120 124 0.24334u / LR 124 125 0.090738n / RR 125 130 68.076m / CL 130 140 2.7354p / LL 130 140 0.10762n / RL 130 140 50.614 / Rs 140 2 7.5416m / **************************** / .ends EMK105BJ105_V-F</Text> / </Model> / </CacheFrame> / </root>
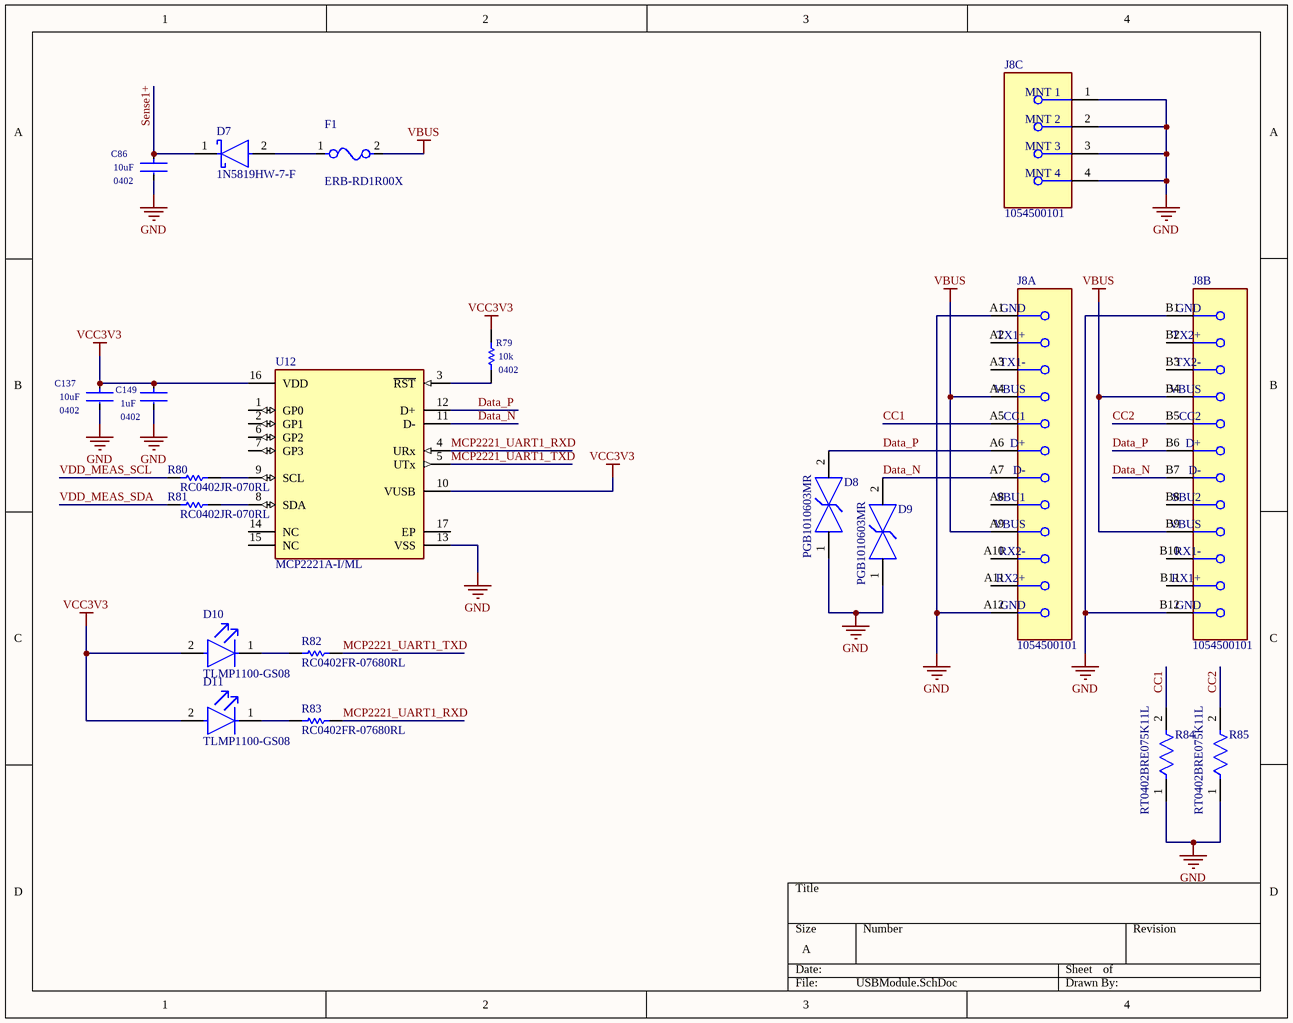
[diagram p9: USBModule.SchDoc]

### Parts
C86  Case/Package: 0402  Capacitance: 10uF  [FP-GRM155-0_2-IPC_B]  (hidden comment: GRM155R60J106ME44D)
C137  Case/Package: 0402  Capacitance: 10uF  [FP-GRM155-0_2-IPC_B]  (hidden comment: GRM155R60J106ME44D)
C149  Case/Package: 0402  Capacitance: 1uF  [FP-0402-L_1_0_0_05-W_0_5-IPC_A]  (hidden comment: EMK105BJ105KV-F)
D7  1N5819HW-7-F  [FP-SOD123-IPC_A]
D8  PGB1010603MR  [FP-PGB1-0603-CA-MFG]
D9  PGB1010603MR  [FP-PGB1-0603-CA-MFG]
D10  TLMP1100-GS08  [FP-6_541-5056_01-4-MFG]
D11  TLMP1100-GS08  [FP-6_541-5056_01-4-MFG]
F1  ERB-RD1R00X  [FP-ERBRD-MFG]
J8  1054500101  [FP-1054500101-MFG]  (parts A,B,C of 3)
R79  Parameter 3: 10k  Parameter 4: 0402  [RESC1005X40X25NL05T10]  (hidden comment: RC0402FR-0710KL)
R80  RC0402JR-070RL  [RESC1005X40X25NL05T10]
R81  RC0402JR-070RL  [RESC1005X40X25NL05T10]
R82  RC0402FR-07680RL  [RESC1005X40X25LL05T10]
R83  RC0402FR-07680RL  [RESC1005X40X25LL05T10]
R84  RT0402BRE075K11L  [FP-RT0402-MFG]
R85  RT0402BRE075K11L  [FP-RT0402-MFG]
U12  MCP2221A-I/ML  [FP-C04-127-MFG]

### Nets
GND: C86.2 C137.2 C149.2 D8.1 D9.1 J8.1(MNT_1) J8.2(MNT_2) J8.3(MNT_3) J8.4(MNT_4) J8.A1(GND) J8.A12(GND) J8.B1(GND) J8.B12(GND) R84.1 R85.1 U12.13(VSS)
VBUS: F1.2 J8.A4(VBUS) J8.A9(VBUS) J8.B4(VBUS) J8.B9(VBUS)
VCC3V3: C137.1 C149.1 D10.2(A) D11.2(A) R79.2 U12.10(VUSB) U12.16(VDD)
CC1: J8.A5(CC1) R84.2
CC2: J8.B5(CC2) R85.2
Data_N: D9.2 J8.A7(D-) J8.B7(D-) U12.11(D-)
Data_P: D8.2 J8.A6(D+) J8.B6(D+) U12.12(D+)
MCP2221_UART1_RXD: R83.2 U12.4(URx)
MCP2221_UART1_TXD: R82.2 U12.5(UTx)
Sense1+: C86.1 D7.1(C)
VDD_MEAS_SCL: R80.1
VDD_MEAS_SDA: R81.1
NetD7_2: D7.2(A) F1.1
NetD10_1: D10.1(C) R82.1
NetD11_1: D11.1(C) R83.1
NetR79_1: R79.1 U12.3(~{RST})
NetR80_2: R80.2 U12.9(SCL)
NetR81_2: R81.2 U12.8(SDA)

Not connected (* = marked no-connect by the designer): J8 A2(TX1+) A3(TX1-) A8(SBU1) A10(RX2-) A11(RX2+) B2(TX2+) B3(TX2-) B8(SBU2) B10(RX1-) B11(RX1+); U12 1(GP0) 2(GP1) 6(GP2) 7(GP3) 14(NC) 15(NC) 17(EP)

### Library data of the parts
C86 C137 = CMP-2000-05265-2: CAP CER 10UF 6.3V X5R 0402; Tolerance: 20%; Voltage Rating: 6.3V; Voltage Rating (DC): 6.3V; Voltage: 6.3V; Case Code (Metric): 1005; REACH SVHC: No SVHC; Min Operating Temperature: -55°C; Height: 0.5mm; Dielectric: X5R; Depth: 0.5mm; Thickness: 0.022inch; Packaging: Tape and Reel; Length: 1mm; Mount: Surface Mount; Package Quantity: 10000; Lead Free: Lead Free; Termination: SMD/SMT; Max Operating Temperature: 85°C; Case Code (Imperial): 0402; Series: GRM; Width: 0.5mm; RoHS Compliant: Yes
C149 = CMP-14477-000104-2: None; Tolerance: 10%; Voltage Rating: 16V; Dielectric: X5R; Packaging: Tape and Reel; Depth: 0.5mm; Mount: Surface Mount; Thickness: 0.022inch; Package Quantity: 1; Min Operating Temperature: -55°C; Series: M; Voltage Rating (DC): 16V; Termination: SMD/SMT; Number of Pins: 2; Case Code (Imperial): 0402; Length: 1mm; Halogen Free: Halogen Free; Case Code (Metric): 1005; Width: 0.02inch; RoHS Compliant: Yes; Radiation Hardening: No; Max Operating Temperature: 85°C; Height: 0.5mm; Construction: Flat
D7 = CMP-0303-00003-3: DIODE SCHOTTKY 40V 1A SOD123; Forward Voltage: 450mV; Capacitance: 110pF; Max Forward Surge Current (Ifsm): 25A; Peak Reverse Current: 50uA; Polarity: Standard; Element Configuration: Single; Max Power Dissipation: 450mW; Min Operating Temperature: -65°C; Package Quantity: 3000; Contact Plating: Tin; Weight: 0.000353oz; Max Repetitive Reverse Voltage (Vrrm): 40V; Max Reverse Voltage (DC): 40V; Height: 1.25mm; Average Rectified Current: 1A; Width: 1.7mm; Case/Package: SOD-123-2; Lead Free: Lead Free; Max Operating Temperature: 125°C; Current Rating: 1A; Termination: SMD/SMT; Forward Current: 1A; Radiation Hardening: No; Number of Pins: 2; Length: 2.85mm; Voltage Rating (DC): 40V; REACH SVHC: No SVHC; Peak Non-Repetitive Surge Current: 25A; Packaging: Tape and Reel; Output Current: 1A
D8 D9 = CMP-2000-05190-2: TVS DIODE 24V 150V 0603; Number of Channels: 1; Power Line Protection: No; Breakdown Voltage: 500V; Direction: Bidirectional; Leakage Current: 1nA; Element Configuration: Single; Capacitance: 0.06pF; Operating Supply Voltage: 24V; Lead Free: Lead Free; Number of Elements: 1; Width: 787um; Reverse Standoff Voltage: 24V; Height: 0.36mm; Number of Bidirectional Channels: 1; Voltage Rating (DC): 24V; Case Code (Metric): 1608; Radiation Hardening: No; Depth: 0.84mm; Max Operating Temperature: 125°C; Length: 1.66mm; Clamping Voltage: 150V; Number of Pins: 2; Case/Package: 0603; Min Operating Temperature: -65°C; Mount: Surface Mount; Case Code (Imperial): 0603; Working Voltage: 24V; Polarity: Bidirectional; Termination: SMD/SMT; Packaging: Tape and Reel; Composition: Zener
D10 D11 = CMP-02520-000009-1: LED GREEN 0603 SMD; Manufacturer: Vishay; Max Junction Temp: +120°C; Automotive Grade: Grade 3; Reverse Voltage: 6V; Led Orientation: Top View; Forward Voltage: 2.1V; Luminous Intensity: 15mcd; Forward Current: 20mA; Colour: Pure green; Peak Emmision Wavelength: 562nm; Wavelength: 561nm; Viewing Angle: 160°; Power Dissipation: 90mW; Digikey Description: LED GREEN 0603 SMD; Package: 6.541-5056.01-4; Ambient Temperature Range High: +100°C; Height: 0.65mm; Device Class L1: Optoelectronics; Device Class L2: LEDs; Mouser Description: Standard LEDs - SMD Pure Green; Temperature Range High: +120°C; RoHS: TRUE; Ambient Temperature Range Low: -40°C; Temperature: to +120°C; Manufacturer Part Number: TLMP1100-GS08; ComponentLink2URL: http://www.vishay.com/docs/83173/tlmb1100.pdf; Lead Free: Yes; Octopart: https://octopart.com/tlmp1100-gs08-vishay-55433993; Automotive: Yes; Device Class L3: unset; ComponentLink2Description: Datasheet; Category: Diode
F1 = CMP-00287-21220529-1: ERB-RD1R00X Fuse Chip Fast Acting 1A 32V SMD Solder Pad 0402 1 X 0.5 X 0.39mm T/R UL/cUL; Body Material: Alumina; Approvals: UL; Resistance: 125mΩ; Case Code (Metric): 1005; Current: 1A; Voltage Rating: 32V; Current Rating: 1A; Depth: 500µm; Lifecycle Status: Production; Max Operating Temperature: 125°C; Case Code (Imperial): 0402; Radiation Hardening: No; Mount: Surface Mount; Height: 490µm; Voltage Rating (DC): 32V; Case/Package: 0402; Min Operating Temperature: -40°C; Fuse Current: 1A; Max Voltage Rating (DC): 32V; Width: 500µm; RoHS: Compliant; Length: 1mm; REACH SVHC: No SVHC; Packaging: Cut Tape; Number of Pins: 2
J8 = CMP-04767-000004-1: CONN RCP USB3.1 TYPEC 24P SMD RA; Manufacturer: Molex; Number Of Contacts: 24; Voltage Rating: 30V; Shielding: true; Is Female: yes; Current Rating: 0.25/1.25/5A; Pitch: 0.5mm; Conn Orientation: Right Angle; Package: 0; Height: 3.44mm; Footprint Url: https://www.molex.com/pdm_docs/sd/1054500101_sd.pdf; Device Class L1: Connectors; Category: Conn; Device Class L2: USB Connectors; Digikey Description: CONN RCP USB3.1 TYPEC 24P SMD RA; Contact Material: Gold,Nickel; Mouser Description: USB Shielded I/O Receptacle; Type C; Right Angle; Surface Mount; Gold over Nickel; ComponentLink2Description: Datasheet; Lead Free: Yes; Automotive: No; Temperature Range High: +85°C; RoHS: TRUE; Octopart: https://octopart.com/105450-0101-molex-68082325; ComponentLink2URL: https://www.molex.com/webdocs/datasheets/pdf/en-us/1054500101_IO_CONNECTORS.pdf; Temperature: -30°C to +85°C; Usb Standard: USB 3.1; Temperature Range Low: -30°C; Device Class L3: unset; Manufacturer Part Number: 1054500101
R79 = CMP-2002-07353-1: Manufacturer: Yageo / Phycomp; Part Number: RC0402FR-0710KL
R80 R81 = CMP-1011-00001-2: Manufacturer: Yageo / Phycomp; Part Number: RC0402JR-070RL
R82 R83 = CMP-2002-07010-1: Manufacturer: Yageo / Phycomp; Part Number: RC0402FR-07680RL
R84 R85 = CMP-03412-002989-1: RES 5.11K OHM 1/16W .1% SMD 0402; Manufacturer: Yageo; Value: 5.11KΩ; Voltage Rating: 50V; Power Rating: 0.063W; Tolerance: 0.001; Temperature Coefficient: 50 ppm/°C; Lead Free: Yes; ComponentLink2URL: http://www.yageo.com/documents/recent/PYu-RT_1-to-0.01_RoHS_L_9.pdf; Category: Res; ComponentLink2Description: Datasheet; Temperature Range Low: -55°C; Device Class L3: Chip SMD Resistors; Automotive: No; Temperature Range High: +155°C; Octopart: https://octopart.com/rt0402bre075k11l-yageo-1442753; Device Class L2: Resistors; Height: 0.35mm; Composition: Thin Film; Package: RT0402; Manufacturer Part Number: RT0402BRE075K11L; RoHS: TRUE; Temperature: -55°C to +155°C; Resistance: 5.11KΩ; Footprint Url: http://www.yageo.com/exep/pages/download/literatures/PYu-R_Mount_10.pdf; Device Class L1: Passive Components; Series: RT; Digikey Description: RES 5.11K OHM 1/16W .1% SMD 0402; Ipc Land Pattern Name: RESC10050X30
U12 = CMP-06284-000031-1: IC USB TO I2C/UART 16QFN; Operating Supply Current: 13mA; Interface: I2C; Packaging: Rail/Tube; Case/Package: VQFN; Max Operating Temperature: 85°C; RoHS Compliant: Yes; Min Operating Temperature: -40°C

## Sheet FPGA_BANKS.SchDoc
size A2; SheetNumber: 9; SheetTotal: 8
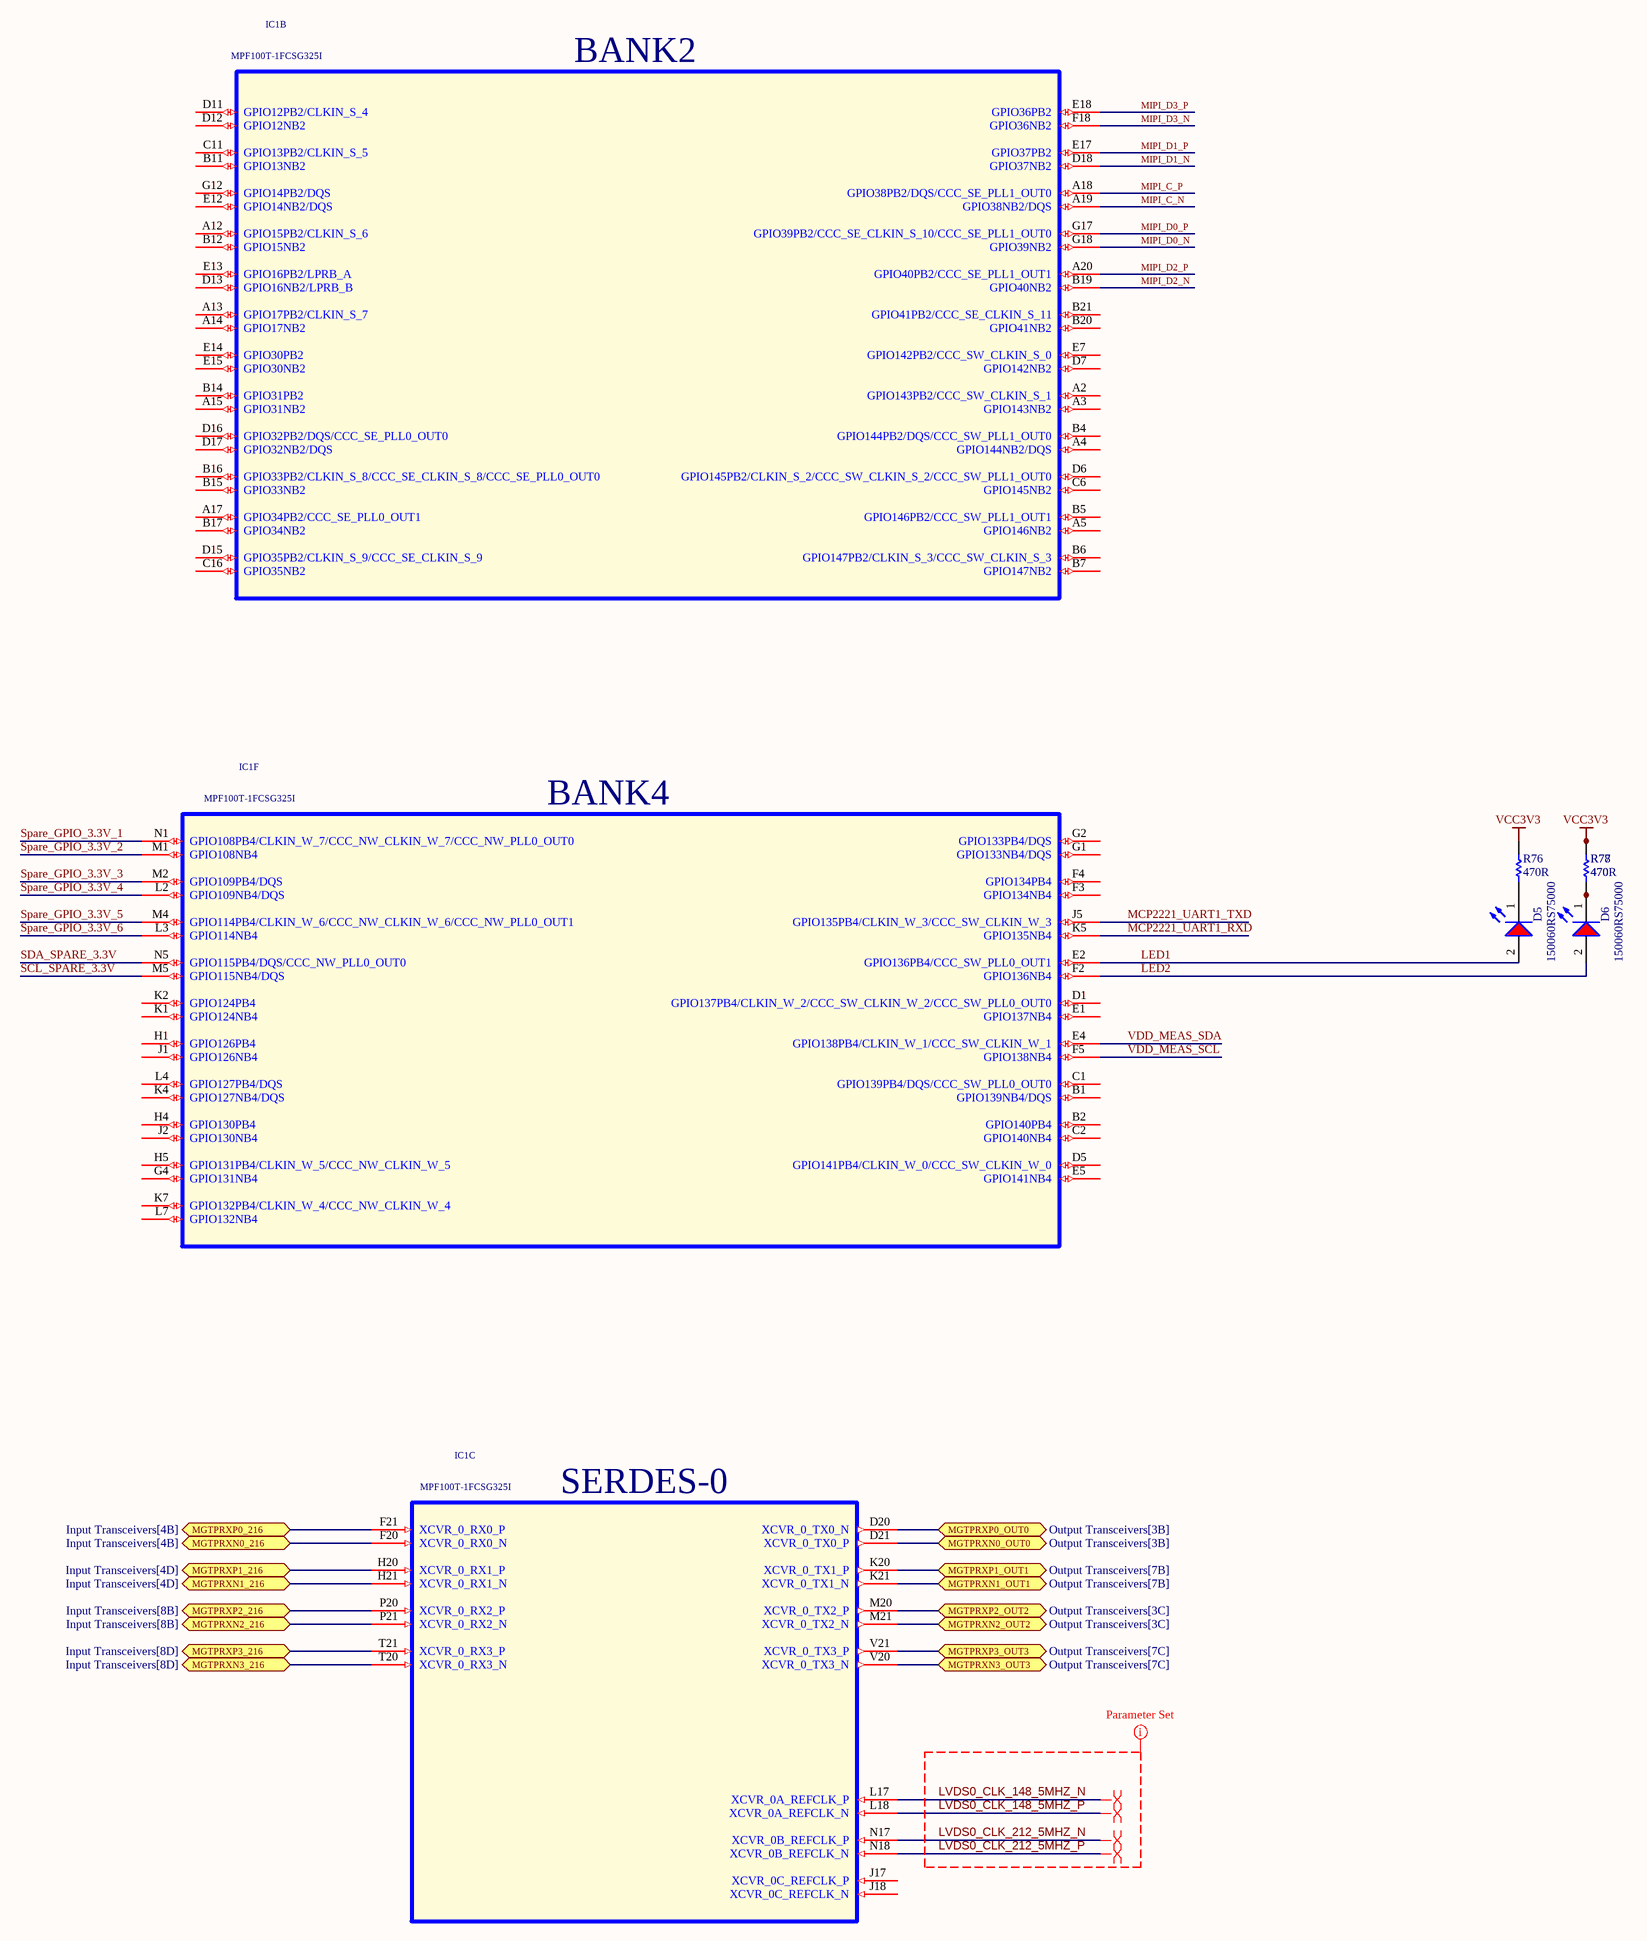
[diagram p10: FPGA_BANKS.SchDoc]

### Parts
D5  150060RS75000  [WL-SMCW_0603_150060xx75000]
D6  150060RS75000  [WL-SMCW_0603_150060xx75000]
IC1  MPF100T-1FCSG325I  [MPF100T-1FCSG325I]  (parts B,C,F of 9)
R76  470R  [RESC1005X40X25ML05T10]
R77  470  [RESC1005X40X25ML05T10]
R78  470R  [RESC1005X40X25ML05T10]

### Ports
MGTPRXN0_216 (bidir, see Input Transceivers[4B]), MGTPRXN0_OUT0 (bidir, see Output Transceivers[3B]), MGTPRXN1_216 (bidir, see Input Transceivers[4D]), MGTPRXN1_OUT1 (bidir, see Output Transceivers[7B]), MGTPRXN2_216 (bidir, see Input Transceivers[8B]), MGTPRXN2_OUT2 (bidir, see Output Transceivers[3C]), MGTPRXN3_216 (bidir, see Input Transceivers[8D]), MGTPRXN3_OUT3 (bidir, see Output Transceivers[7C]), MGTPRXP0_216 (bidir, see Input Transceivers[4B]), MGTPRXP0_OUT0 (bidir, see Output Transceivers[3B]), MGTPRXP1_216 (bidir, see Input Transceivers[4D]), MGTPRXP1_OUT1 (bidir, see Output Transceivers[7B]), MGTPRXP2_216 (bidir, see Input Transceivers[8B]), MGTPRXP2_OUT2 (bidir, see Output Transceivers[3C]), MGTPRXP3_216 (bidir, see Input Transceivers[8D]), MGTPRXP3_OUT3 (bidir, see Output Transceivers[7C])

### Nets
VCC3V3: R76.2 R77.2 R78.2
LED1: D5.2(A) IC1.E2(GPIO136PB4/CCC_SW_PLL0_OUT1)
LED2: D6.2(A) IC1.F2(GPIO136NB4)
LVDS0_CLK_148_5MHZ_N: IC1.L17(XCVR_0A_REFCLK_P)
LVDS0_CLK_148_5MHZ_P: IC1.L18(XCVR_0A_REFCLK_N)
LVDS0_CLK_212_5MHZ_N: IC1.N17(XCVR_0B_REFCLK_P)
LVDS0_CLK_212_5MHZ_P: IC1.N18(XCVR_0B_REFCLK_N)
MCP2221_UART1_RXD: IC1.K5(GPIO135NB4)
MCP2221_UART1_TXD: IC1.J5(GPIO135PB4/CLKIN_W_3/CCC_SW_CLKIN_W_3)
MIPI_C_N: IC1.A19(GPIO38NB2/DQS)
MIPI_C_P: IC1.A18(GPIO38PB2/DQS/CCC_SE_PLL1_OUT0)
MIPI_D0_N: IC1.G18(GPIO39NB2)
MIPI_D0_P: IC1.G17(GPIO39PB2/CCC_SE_CLKIN_S_10/CCC_SE_PLL1_OUT0)
MIPI_D1_N: IC1.D18(GPIO37NB2)
MIPI_D1_P: IC1.E17(GPIO37PB2)
MIPI_D2_N: IC1.B19(GPIO40NB2)
MIPI_D2_P: IC1.A20(GPIO40PB2/CCC_SE_PLL1_OUT1)
MIPI_D3_N: IC1.F18(GPIO36NB2)
MIPI_D3_P: IC1.E18(GPIO36PB2)
SCL_SPARE_3.3V: IC1.M5(GPIO115NB4/DQS)
SDA_SPARE_3.3V: IC1.N5(GPIO115PB4/DQS/CCC_NW_PLL0_OUT0)
Spare_GPIO_3.3V_1: IC1.N1(GPIO108PB4/CLKIN_W_7/CCC_NW_CLKIN_W_7/CCC_NW_PLL0_OUT0)
Spare_GPIO_3.3V_2: IC1.M1(GPIO108NB4)
Spare_GPIO_3.3V_3: IC1.M2(GPIO109PB4/DQS)
Spare_GPIO_3.3V_4: IC1.L2(GPIO109NB4/DQS)
Spare_GPIO_3.3V_5: IC1.M4(GPIO114PB4/CLKIN_W_6/CCC_NW_CLKIN_W_6/CCC_NW_PLL0_OUT1)
Spare_GPIO_3.3V_6: IC1.L3(GPIO114NB4)
VDD_MEAS_SCL: IC1.F5(GPIO138NB4)
VDD_MEAS_SDA: IC1.E4(GPIO138PB4/CLKIN_W_1/CCC_SW_CLKIN_W_1)
NetC28_2: IC1.F21(XCVR_0_RX0_P) ; port MGTPRXP0_216
NetC30_2: IC1.P20(XCVR_0_RX2_P) ; port MGTPRXP2_216
NetC32_2: IC1.F20(XCVR_0_RX0_N) ; port MGTPRXN0_216
NetC34_2: IC1.P21(XCVR_0_RX2_N) ; port MGTPRXN2_216
NetC44_2: IC1.H20(XCVR_0_RX1_P) ; port MGTPRXP1_216
NetC46_2: IC1.T21(XCVR_0_RX3_P) ; port MGTPRXP3_216
NetC48_2: IC1.H21(XCVR_0_RX1_N) ; port MGTPRXN1_216
NetC50_2: IC1.T20(XCVR_0_RX3_N) ; port MGTPRXN3_216
NetC51_2: IC1.D20(XCVR_0_TX0_N) ; port MGTPRXP0_OUT0
NetC52_2: IC1.D21(XCVR_0_TX0_P) ; port MGTPRXN0_OUT0
NetC60_2: IC1.K20(XCVR_0_TX1_P) ; port MGTPRXP1_OUT1
NetC62_2: IC1.K21(XCVR_0_TX1_N) ; port MGTPRXN1_OUT1
NetC76_2: IC1.V21(XCVR_0_TX3_P) ; port MGTPRXP3_OUT3
NetC77_2: IC1.M20(XCVR_0_TX2_P) ; port MGTPRXP2_OUT2
NetC80_2: IC1.V20(XCVR_0_TX3_N) ; port MGTPRXN3_OUT3
NetC81_2: IC1.M21(XCVR_0_TX2_N) ; port MGTPRXN2_OUT2
NetD5_1: D5.1(K) R76.1
NetD6_1: D6.1(K) R77.1 R78.1

Not connected (* = marked no-connect by the designer): IC1 A2(GPIO143PB2/CCC_SW_CLKIN_S_1) A3(GPIO143NB2) A4(GPIO144NB2/DQS) A5(GPIO146NB2) A12(GPIO15PB2/CLKIN_S_6) A13(GPIO17PB2/CLKIN_S_7) A14(GPIO17NB2) A15(GPIO31NB2) A17(GPIO34PB2/CCC_SE_PLL0_OUT1) B1(GPIO139NB4/DQS) B2(GPIO140PB4) B4(GPIO144PB2/DQS/CCC_SW_PLL1_OUT0) B5(GPIO146PB2/CCC_SW_PLL1_OUT1) B6(GPIO147PB2/CLKIN_S_3/CCC_SW_CLKIN_S_3) B7(GPIO147NB2) B11(GPIO13NB2) B12(GPIO15NB2) B14(GPIO31PB2) B15(GPIO33NB2) B16(GPIO33PB2/CLKIN_S_8/CCC_SE_CLKIN_S_8/CCC_SE_PLL0_OUT0) B17(GPIO34NB2) B20(GPIO41NB2) B21(GPIO41PB2/CCC_SE_CLKIN_S_11) C1(GPIO139PB4/DQS/CCC_SW_PLL0_OUT0) C2(GPIO140NB4) C6(GPIO145NB2) C11(GPIO13PB2/CLKIN_S_5) C16(GPIO35NB2) D1(GPIO137PB4/CLKIN_W_2/CCC_SW_CLKIN_W_2/CCC_SW_PLL0_OUT0) D5(GPIO141PB4/CLKIN_W_0/CCC_SW_CLKIN_W_0) D6(GPIO145PB2/CLKIN_S_2/CCC_SW_CLKIN_S_2/CCC_SW_PLL1_OUT0) D7(GPIO142NB2) D11(GPIO12PB2/CLKIN_S_4) D12(GPIO12NB2) D13(GPIO16NB2/LPRB_B) D15(GPIO35PB2/CLKIN_S_9/CCC_SE_CLKIN_S_9) D16(GPIO32PB2/DQS/CCC_SE_PLL0_OUT0) D17(GPIO32NB2/DQS) E1(GPIO137NB4) E5(GPIO141NB4) E7(GPIO142PB2/CCC_SW_CLKIN_S_0) E12(GPIO14NB2/DQS) E13(GPIO16PB2/LPRB_A) E14(GPIO30PB2) E15(GPIO30NB2) F3(GPIO134NB4) F4(GPIO134PB4) G1(GPIO133NB4/DQS) G2(GPIO133PB4/DQS) G4(GPIO131NB4) G12(GPIO14PB2/DQS) H1(GPIO126PB4) H4(GPIO130PB4) H5(GPIO131PB4/CLKIN_W_5/CCC_NW_CLKIN_W_5) J1(GPIO126NB4) J2(GPIO130NB4) J17(XCVR_0C_REFCLK_P) J18(XCVR_0C_REFCLK_N) K1(GPIO124NB4) K2(GPIO124PB4) K4(GPIO127NB4/DQS) K7(GPIO132PB4/CLKIN_W_4/CCC_NW_CLKIN_W_4) L4(GPIO127PB4/DQS) L7(GPIO132NB4)

### Layout directives
differential pair: LVDS0_CLK_148_5MHZ_N, LVDS0_CLK_148_5MHZ_P, LVDS0_CLK_212_5MHZ_N, LVDS0_CLK_212_5MHZ_P

### Notes on the sheet
- (in symbol MPF100T-1FCSG325I, part B) BANK2
- (in symbol MPF100T-1FCSG325I, part C) SERDES-0
- (in symbol MPF100T-1FCSG325I, part F) BANK4

### Library data of the parts
D5 D6 = CMP-1426-00001-4: LED Low-Power Uni-Color Red 630nm 2V 2-Pin Chip 0603(1608Metric) T/R; Max Junction Temperature (Tj): 95°C; Dominant Wavelength: 625nm; Lens Style: Clear, Rectangular; Viewing Angle: 140°; Forward Current: 100mA; Max Reverse Voltage (DC): 5V; Luminous Intensity: 250mcd; Test Current: 20mA; Power Dissipation: 72mW; Max Operating Temperature: 85°C; Mount: Surface Mount; Height: 700µm; Packaging: Tape and Reel; REACH SVHC: Unknown; Case Code (Metric): 1608; Peak Wavelength: 630nm; Forward Voltage: 2V; Case/Package: 0603; Color: Red; RoHS: Compliant; Width: 800µm; Reverse Voltage: 5V; Min Operating Temperature: -40°C; Wavelength: 625nm; Case Code (Imperial): 0603; Length: 1.6mm
IC1 = MPF100T-1FCSG325I: Part_Number: J00001; Part_Name: Jumper; ID: 110; Mounting_Type: SMT; ComponentLink1Description: Datasheet
R76-R78 = CMP-2002-07697-1: Part Number: RC0402FR-07470RL; Manufacturer: Yageo / Phycomp

## Nets that join several sheets
3P3V: Power and Decoupling Capacitors (12 pins), JTAG & Reset Connection (12 pins)
5V0: Connector (C145.1 C146.1 J6.27), PMIC (32 pins)
GND: Connector (22 pins), PMIC (63 pins), Power and Decoupling Capacitors (102 pins), DRAM+BANK1 (16 pins), Input Transceivers (50 pins), Output Transceivers (40 pins), JTAG & Reset Connection (14 pins), USBModule (16 pins)
VCC1V0: PMIC (6 pins), Power and Decoupling Capacitors (29 pins)
VCC1V2: PMIC (C7.1 C67.1 L3.2 R6.2), Input Transceivers (24 pins), Output Transceivers (20 pins)
VCC1V8: PMIC (5 pins), Power and Decoupling Capacitors (8 pins), DRAM+BANK1 (16 pins)
VCC2V5: PMIC (5 pins), Power and Decoupling Capacitors (23 pins)
VCC3V3: Connector (9 pins), PMIC (12 pins), Power and Decoupling Capacitors (5 pins), Output Transceivers (14 pins), USBModule (7 pins), FPGA_BANKS (R76.2 R77.2 R78.2)
LVDS0_CLK_148_5MHZ_N: Output Transceivers (R17.2 U5.5), FPGA_BANKS (IC1.L17)
LVDS0_CLK_148_5MHZ_P: Output Transceivers (R17.1 U5.4), FPGA_BANKS (IC1.L18)
LVDS0_CLK_212_5MHZ_N: Output Transceivers (R13.2 U3.5), FPGA_BANKS (IC1.N17)
LVDS0_CLK_212_5MHZ_P: Output Transceivers (R13.1 U3.4), FPGA_BANKS (IC1.N18)
MCP2221_UART1_RXD: USBModule (R83.2 U12.4), FPGA_BANKS (IC1.K5)
MCP2221_UART1_TXD: USBModule (R82.2 U12.5), FPGA_BANKS (IC1.J5)
MIPI_C_N: Connector (J6.7), FPGA_BANKS (IC1.A19)
MIPI_C_P: Connector (J6.6), FPGA_BANKS (IC1.A18)
MIPI_D0_N: Connector (J6.9), FPGA_BANKS (IC1.G18)
MIPI_D0_P: Connector (J6.8), FPGA_BANKS (IC1.G17)
MIPI_D1_N: Connector (J6.4), FPGA_BANKS (IC1.D18)
MIPI_D1_P: Connector (J6.3), FPGA_BANKS (IC1.E17)
MIPI_D2_N: Connector (J6.11), FPGA_BANKS (IC1.B19)
MIPI_D2_P: Connector (J6.10), FPGA_BANKS (IC1.A20)
MIPI_D3_N: Connector (J6.2), FPGA_BANKS (IC1.F18)
MIPI_D3_P: Connector (J6.1), FPGA_BANKS (IC1.E18)
NetC28_2: Input Transceivers (C28.2), FPGA_BANKS (IC1.F21)
NetC30_2: Input Transceivers (C30.2), FPGA_BANKS (IC1.P20)
NetC32_2: Input Transceivers (C32.2), FPGA_BANKS (IC1.F20)
NetC34_2: Input Transceivers (C34.2), FPGA_BANKS (IC1.P21)
NetC44_2: Input Transceivers (C44.2), FPGA_BANKS (IC1.H20)
NetC46_2: Input Transceivers (C46.2), FPGA_BANKS (IC1.T21)
NetC48_2: Input Transceivers (C48.2), FPGA_BANKS (IC1.H21)
NetC50_2: Input Transceivers (C50.2), FPGA_BANKS (IC1.T20)
NetC51_2: Output Transceivers (C51.2), FPGA_BANKS (IC1.D20)
NetC52_2: Output Transceivers (C52.2), FPGA_BANKS (IC1.D21)
NetC60_2: Output Transceivers (C60.2), FPGA_BANKS (IC1.K20)
NetC62_2: Output Transceivers (C62.2), FPGA_BANKS (IC1.K21)
NetC76_2: Output Transceivers (C76.2), FPGA_BANKS (IC1.V21)
NetC77_2: Output Transceivers (C77.2), FPGA_BANKS (IC1.M20)
NetC80_2: Output Transceivers (C80.2), FPGA_BANKS (IC1.V20)
NetC81_2: Output Transceivers (C81.2), FPGA_BANKS (IC1.M21)
SCL_SPARE_3.3V: Connector (J6.22), FPGA_BANKS (IC1.M5)
SDA_SPARE_3.3V: Connector (J6.21), FPGA_BANKS (IC1.N5)
Sense1+: PMIC (6 pins), USBModule (C86.1 D7.1)
Spare_GPIO_3.3V_1: Connector (J6.13), FPGA_BANKS (IC1.N1)
Spare_GPIO_3.3V_2: Connector (J6.14), FPGA_BANKS (IC1.M1)
Spare_GPIO_3.3V_3: Connector (J6.16), FPGA_BANKS (IC1.M2)
Spare_GPIO_3.3V_4: Connector (J6.17), FPGA_BANKS (IC1.L2)
Spare_GPIO_3.3V_5: Connector (J6.19), FPGA_BANKS (IC1.M4)
Spare_GPIO_3.3V_6: Connector (J6.20), FPGA_BANKS (IC1.L3)
VDD_MEAS_SCL: PMIC (R61.1 U8.9), USBModule (R80.1), FPGA_BANKS (IC1.F5)
VDD_MEAS_SDA: PMIC (R62.1 U8.8), USBModule (R81.1), FPGA_BANKS (IC1.E4)